# Altium project GN-1846-A-V2_RTL8211E.PrjPcb
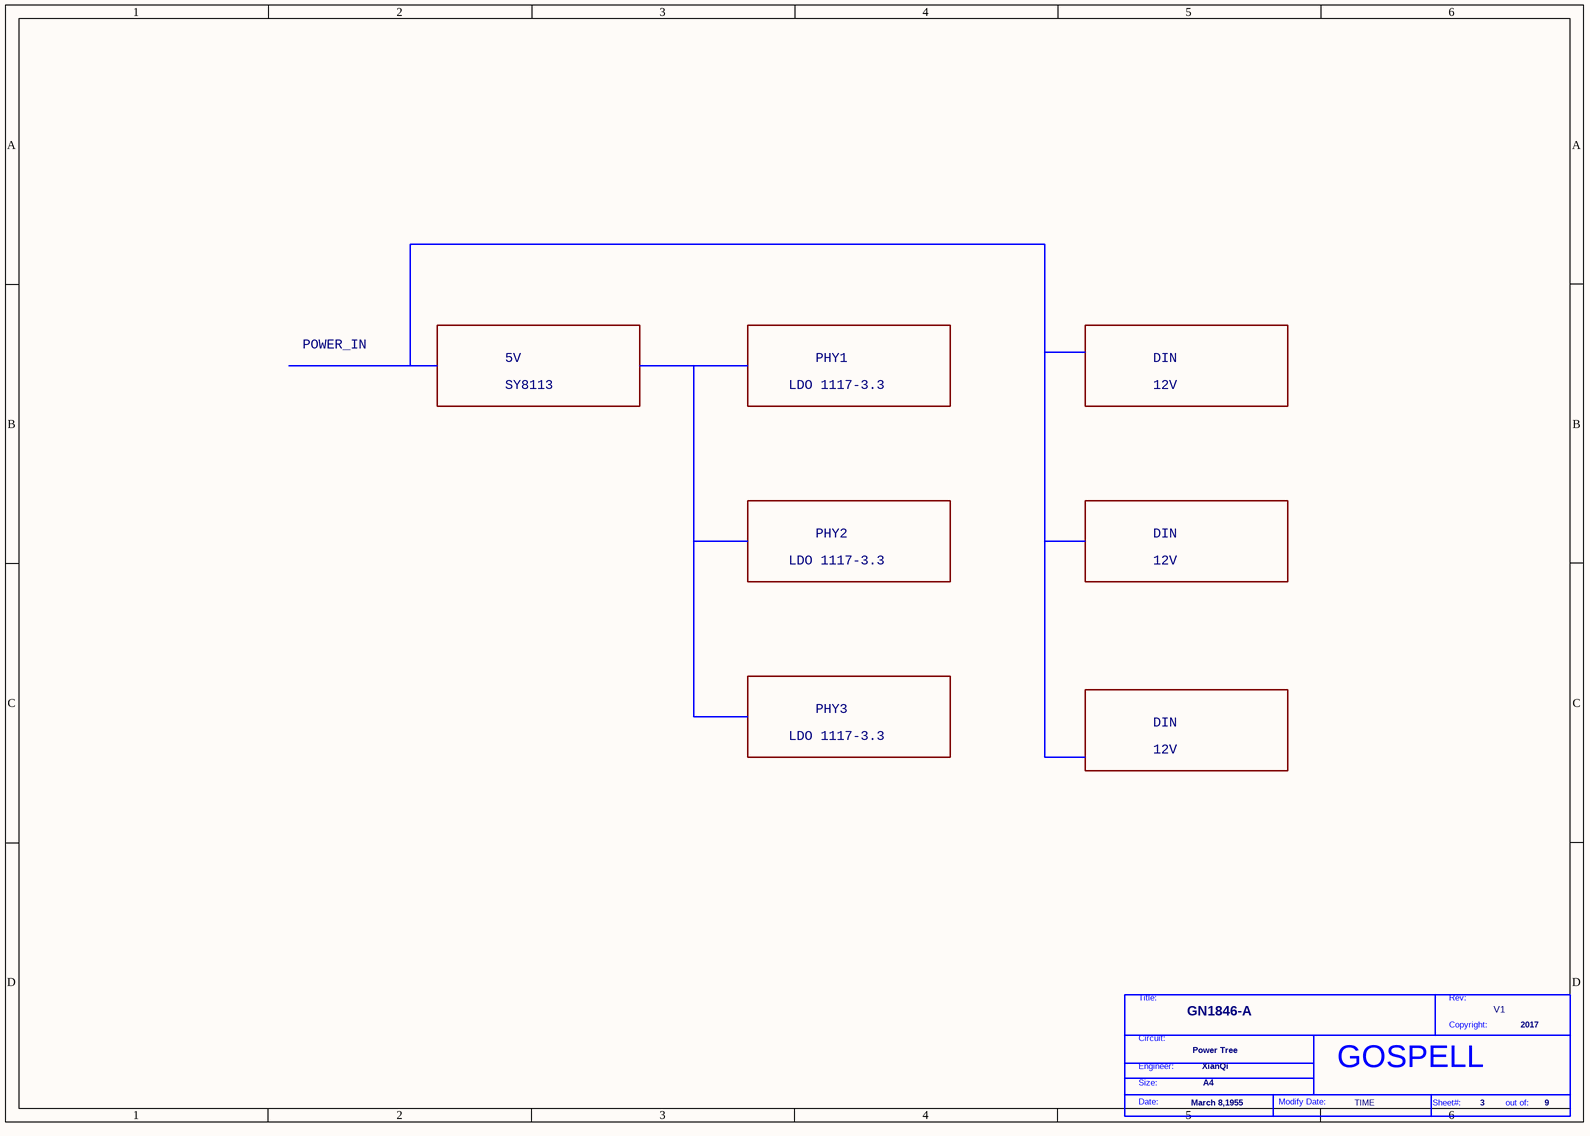
[diagram p0: P03 Power Tree.SchDoc]
9 sheets, 459 parts. Net scope: flat (ports and power ports of the same name join across sheets).
Board file: GN-1846-A-V2.PcbDoc
Sheets:
  P03 Power Tree.SchDoc
  P04 Power.SchDoc
  P07 PHY 2.SchDoc
  P09 CONNECT & LED.SchDoc
  P08 PHY 3.SchDoc
  P06 PHY 1.SchDoc
  P05 CPLD.SchDoc
  P02 Block.SchDoc
  P01 Note & Title.SchDoc

## Sheet P03 Power Tree.SchDoc
size 297 x 209 mm

### Parts
(Parts that share a designator on the sheet are numbered #1, #2 ... from top to bottom, then left to right.)
*#1  Doc: Power Tree  Page Count: 9  Page Number: 3  Page Create Date: March 8,1955  Page Size: A4  RevCode: V1  Title: GN1846-A  Copyright: 2017  Engineer: XianQi  Page Modify Date: TIME  (hidden comment: GOSPELL)  (graphical)

### Notes on the sheet
- POWER_IN
- 5V
- SY8113
- LDO 1117-3.3
- PHY1
- DIN
- 12V
- PHY2
- PHY3
- (in symbol GOSPELL) Title:; Rev:; Copyright:; Circuit:; Engineer:; Size:; Date:; Modify Date:; Sheet#:; out of:

### Library data of the parts
*#1 = GOSPELL: Cage Code: 2017; Schematic Page Count: 9; Schematic Page Number: 3

## Sheet P04 Power.SchDoc
size 246 x 182 mm
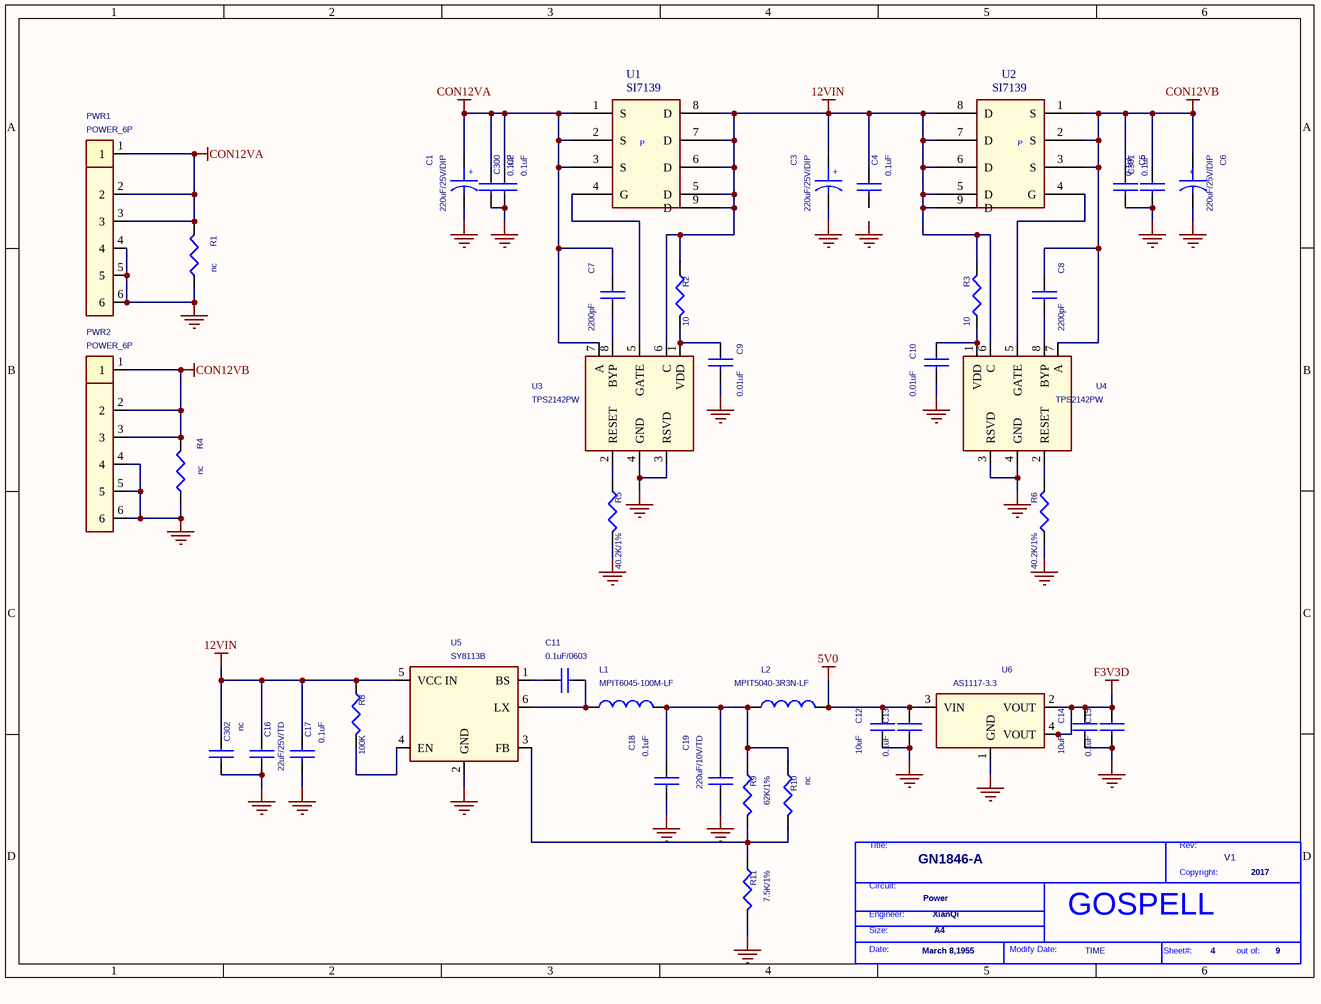
[diagram p1: P04 Power.SchDoc]

### Parts
(Parts that share a designator on the sheet are numbered #1, #2 ... from top to bottom, then left to right.)
*#2  Doc: Power  Page Count: 9  Page Number: 4  Page Create Date: March 8,1955  Page Size: A4  RevCode: V1  Title: GN1846-A  Copyright: 2017  Engineer: XianQi  Page Modify Date: TIME  (hidden comment: GOSPELL)  (graphical)
C1  220uF/25V/DIP  [CE8X3.5]
C2  0.1uF  [0402C]
C3  220uF/25V/DIP  [CE8X3.5]
C4  0.1uF  [0402C]
C5  0.1uF  [0402C]
C6  220uF/25V/DIP  [CE8X3.5]
C7  2200pF  [0402C]
C8  2200pF  [0402C]
C9  0.01uF  [0402C]
C10  0.01uF  [0402C]
C11  0.1uF/0603  [0402C]
C12  10uF  [C0603]
C13  0.1uF  [0402C]
C14  10uF  [C0603]
C15  0.1uF  [0402C]
C16  22uF/25V/TD  [C6032]
C17  0.1uF  [0402C]
C18  0.1uF  [0402C]
C19  220uF/10V/TD  [C6032]
C300  0.1uF  [C1206]
C301  0.1uF  [C1206]
C302  nc  [C1206]
L1  MPIT6045-100M-LF  [MPI6045]
L2  MPIT5040-3R3N-LF  [FB0805]
PWR1  POWER_6P  [TJC2-6]
PWR2  POWER_6P  [TJC2-6]
R1  nc  [0805]
R2  10  [R0603]
R3  10  [R0603]
R4  nc  [0805]
R5  40.2K/1%  [0402R]
R6  40.2K/1%  [0402R]
R8  100K  [0402R]
R9  62K/1%  [0402R]
R10  nc  [0402R]
R11  7.5K/1%  [0402R]
U1  SI7139  [PowerPAKSO8]
U2  SI7139  [PowerPAKSO8]
U3  TPS2142PW  [TSSOP-8]
U4  TPS2142PW  [TSSOP-8]
U5  SY8113B  [SOT23_6_G]
U6  AS1117-3.3  [SOT223]

### Nets
5V0: C12.1 C13.1 L2.2 U6.3(VIN)
12VIN: C3.1 C4.1 C16.1 C17.1 C302.1 R2.1 R3.1 R8.1 U1.5(D) U1.6(D) U1.7(D) U1.8(D) U1.9(D) U2.5(D) U2.6(D) U2.7(D) U2.8(D) U2.9(D) U3.6(C) U4.6(C) U5.5(VCC_IN)
CON12VA: C1.1 C2.1 C7.1 C300.1 PWR1.1 PWR1.2 PWR1.3 R1.1 U1.1(S) U1.2(S) U1.3(S) U3.7(A)
CON12VB: C5.1 C6.1 C8.1 C301.1 PWR2.1 PWR2.2 PWR2.3 R4.1 U2.1(S) U2.2(S) U2.3(S) U4.7(A)
F3V3D: C14.1 C15.1 U6.2(VOUT) U6.4(VOUT)
GND: C1.2 C2.2 C3.2 C5.2 C6.2 C9.2 C10.2 C12.2 C13.2 C14.2 C15.2 C16.2 C17.2 C18.2 C19.2 C300.2 C301.2 C302.2 PWR1.4 PWR1.5 PWR1.6 PWR2.4 PWR2.5 PWR2.6 R1.2 R4.2 R5.2 R6.2 R11.2 U3.3(RSVD) U3.4(GND) U4.3(RSVD) U4.4(GND) U5.2(GND) U6.1(GND)
NetC7_2: C7.2 U3.8(BYP)
NetC8_2: C8.2 U4.8(BYP)
NetC9_1: C9.1 R2.2 U3.1(VDD)
NetC10_1: C10.1 R3.2 U4.1(VDD)
NetC11_1: C11.1 U5.1(BS)
NetC11_2: C11.2 L1.1 U5.6(LX)
NetC18_1: C18.1 C19.1 L1.2 L2.1 R9.1 R10.1
NetR5_1: R5.1 U3.2(RESET)
NetR6_1: R6.1 U4.2(RESET)
NetR8_2: R8.2 U5.4(EN)
NetR9_2: R9.2 R10.2 R11.1 U5.3(FB)
NetU1_4: U1.4(G) U3.5(GATE)
NetU2_4: U2.4(G) U4.5(GATE)

Not connected (* = marked no-connect by the designer): C4 2

### Notes on the sheet
- Labels drawn without touching a wire or pin: GND
- (in symbol CAP POL) +
- (in symbol GOSPELL) Title:; Rev:; Copyright:; Circuit:; Engineer:; Size:; Date:; Modify Date:; Sheet#:; out of:
- (in symbol SI7139) P

### Library data of the parts
C1 C3 C6 = CAP POL
C2 C4 C5 C7-C11 C16-C19 C300-C302 = CAP NP
C12-C15 = CAP NP_Dup1
L1 L2 = CHOKE TORROID_0
PWR1 PWR2 = POWER_4P
R1-R6 R8-R11 = R
U5 = SY8120
U6 = AS1117-X_0
*#2 = GOSPELL: Cage Code: 2017; Schematic Page Count: 9; Schematic Page Number: 4

## Sheet P07 PHY 2.SchDoc
size 420 x 297 mm
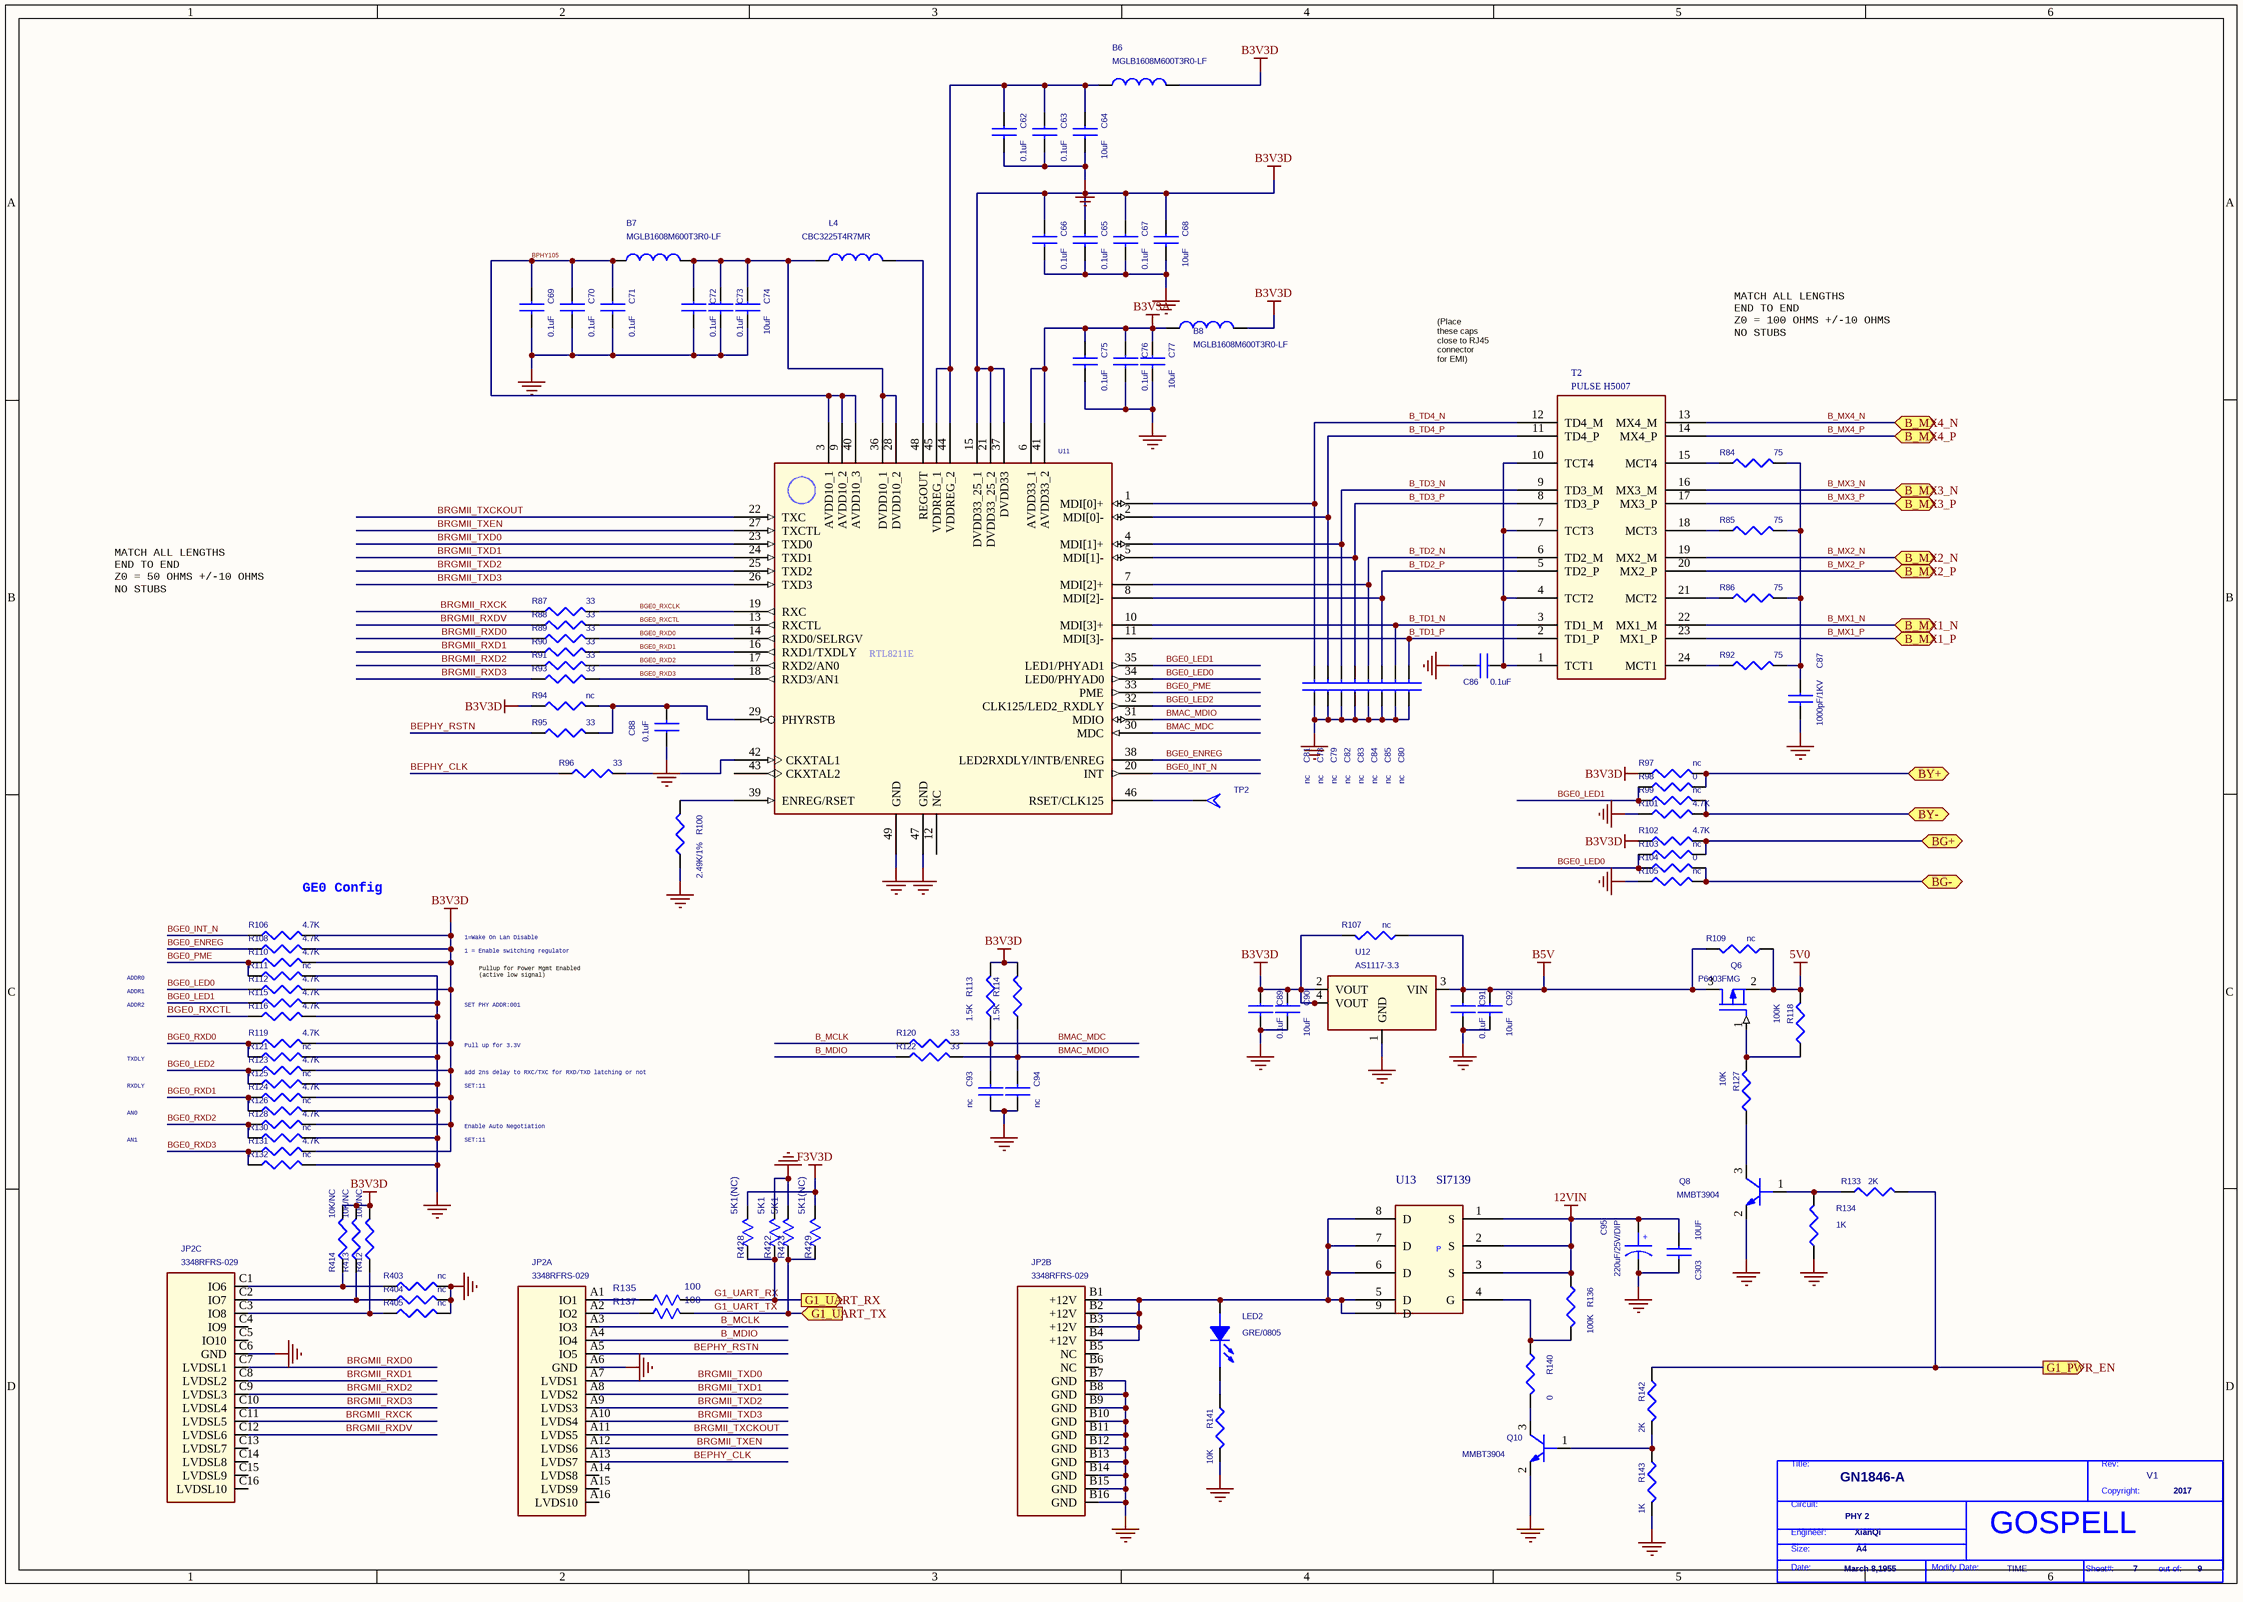
[diagram p2: P07 PHY 2.SchDoc]

### Parts
(Parts that share a designator on the sheet are numbered #1, #2 ... from top to bottom, then left to right.)
*#3  Doc: PHY 2  Page Count: 9  Page Number: 7  Page Create Date: March 8,1955  Page Size: A4  RevCode: V1  Title: GN1846-A  Copyright: 2017  Engineer: XianQi  Page Modify Date: TIME  (hidden comment: GOSPELL)  (graphical)
B6  MGLB1608M600T3R0-LF  [L0603]
B7  MGLB1608M600T3R0-LF  [L0603]
B8  MGLB1608M600T3R0-LF  [L0603]
C62  0.1uF  [0402C]
C63  0.1uF  [0402C]
C64  10uF  [C0603]
C65  0.1uF  [0402C]
C66  0.1uF  [0402C]
C67  0.1uF  [0402C]
C68  10uF  [C0603]
C69  0.1uF  [0402C]
C70  0.1uF  [0402C]
C71  0.1uF  [0402C]
C72  0.1uF  [0402C]
C73  0.1uF  [0402C]
C74  10uF  [C0603]
C75  0.1uF  [0402C]
C76  0.1uF  [0402C]
C77  10uF  [C0603]
C78  nc  [0402C]
C79  nc  [0402C]
C80  nc  [0402C]
C81  nc  [0402C]
C82  nc  [0402C]
C83  nc  [0402C]
C84  nc  [0402C]
C85  nc  [0402C]
C86  0.1uF  [0402C]
C87  1000pF/1KV  [C1206]
C88  0.1uF  [0402C]
C89  0.1uF  [0402C]
C90  10uF  [C0603]
C91  0.1uF  [0402C]
C92  10uF  [C0603]
C93  nc  [0402C]
C94  nc  [0402C]
C95  220uF/25V/DIP  [CE8X3.5]
C303  10UF  [C1206]
JP2  3348RFRS-029  [3348RFRS-029]  (parts A,B,C of 3)
L4  CBC3225T4R7MR  [FB0805]
LED2  GRE/0805  [LED0805]
Q6  P6403FMG  [SOT23]
Q8  MMBT3904  [SOT23]
Q10  MMBT3904  [SOT23]
R84  75  [0402R]
R85  75  [0402R]
R86  75  [0402R]
R87  33  [0402R]
R88  33  [0402R]
R89  33  [0402R]
R90  33  [0402R]
R91  33  [0402R]
R92  75  [0402R]
R93  33  [0402R]
R94  nc  [0402R]
R95  33  [0402R]
R96  33  [0402R]
R97  nc  [0402R]
R98  0  [0402R]
R99  nc  [0402R]
R100  2.49K/1%  [0402R]
R101  4.7K  [0402R]
R102  4.7K  [0402R]
R103  nc  [0402R]
R104  0  [0402R]
R105  nc  [0402R]
R106  4.7K  [0402R]
R107  nc  [R0603]
R108  4.7K  [0402R]
R109  nc  [R0603]
R110  4.7K  [0402R]
R111  nc  [0402R]
R112  4.7K  [0402R]
R113  1.5K  [0402R]
R114  1.5K  [0402R]
R115  4.7K  [0402R]
R116  4.7K  [0402R]
R118  100K  [0402R]
R119  4.7K  [0402R]
R120  33  [0402R]
R121  nc  [0402R]
R122  33  [0402R]
R123  4.7K  [0402R]
R124  4.7K  [0402R]
R125  nc  [0402R]
R126  nc  [0402R]
R127  10K  [0402R]
R128  4.7K  [0402R]
R130  nc  [0402R]
R131  4.7K  [0402R]
R132  nc  [0402R]
R133  2K  [0402R]
R134  1K  [0402R]
R135  100  [0402R]
R136  100K  [R0603]
R137  100  [0402R]
R140  0  [0402R]
R141  10K  [0402R]
R142  2K  [0402R]
R143  1K  [0402R]
R403  nc  [0402R]
R404  nc  [0402R]
R405  nc  [0402R]
R412  10K/NC  [0402R]
R413  10K/NC  [0402R]
R414  10K/NC  [0402R]
R422  5K1  [0402R]
R423  5K1  [0402R]
R428  5K1(NC)  [0402R]
R429  5K1(NC)  [0402R]
T2  PULSE H5007  [H5007-H]
TP2  T POINT A  [TP_G]  (value not drawn)
U11  RTL8211D  [QFN-48P-RTL8211]  (value not drawn)
U12  AS1117-3.3  [SOT223]
U13  SI7139  [PowerPAKSO8]

### Ports
B_MX1_N (bidir), B_MX1_P (bidir), B_MX2_N (bidir), B_MX2_P (bidir), B_MX3_N (bidir), B_MX3_P (bidir), B_MX4_N (bidir), B_MX4_P (bidir), BG+ (bidir), BG- (bidir), BY+ (bidir), BY- (bidir), G1_PWR_EN (out), G1_UART_RX (out), G1_UART_TX (in)

### Nets
5V0: Q6.2(SOURCE) R109.2 R118.1
12VIN: C95.1 C303.1 R136.2 U13.1(S) U13.2(S) U13.3(S)
B3V3A: B8.1 C75.1 C76.1 C77.1 U11.6(AVDD33_1) U11.41(AVDD33_2)
B3V3D: B6.2 B8.2 C65.1 C66.1 C67.1 C68.1 C89.1 C90.1 R94.1 R97.1 R102.1 R106.2 R107.1 R108.2 R110.2 R112.2 R113.2 R114.2 R119.2 R123.2 R124.2 R128.2 R131.2 R412.2 R413.2 R414.2 U11.15(DVDD33_25_1) U11.21(DVDD33_25_2) U11.37(DVDD33) U12.2(VOUT) U12.4(VOUT)
B5V: C91.1 C92.1 Q6.3(DRAIN) R107.2 R109.1 U12.3(VIN)
F3V3D: R428.2(B) R429.2(B)
GND: C62.2 C63.2 C64.2 C65.2 C66.2 C67.2 C68.2 C69.2 C70.2 C71.2 C72.2 C73.2 C74.2 C75.2 C76.2 C77.2 C78.1 C79.1 C80.1 C81.1 C82.1 C83.1 C84.1 C85.1 C86.2 C87.2 C88.1 C89.2 C90.2 C91.2 C92.2 C93.1 C94.1 C95.2 C303.2 JP2.A6(GND) JP2.B7(GND) JP2.B8(GND) JP2.B9(GND) JP2.B10(GND) JP2.B11(GND) JP2.B12(GND) JP2.B13(GND) JP2.B14(GND) JP2.B15(GND) JP2.B16(GND) JP2.C6(GND) Q8.2(EMITTER) Q10.2(EMITTER) R100.1 R101.1 R105.1 R111.2 R115.2 R116.2 R121.2 R125.2 R126.2 R130.2 R132.2 R134.1 R141.1 R143.1 R403.2 R404.2 R405.2 R422.2(B) R423.2(B) U11.47(GND) U11.49(GND) U12.1(GND)
B_MCLK: JP2.A3(IO3) R120.1
B_MDIO: JP2.A4(IO4) R122.1
B_MX1_N: T2.22(MX1_M) ; port B_MX1_N
B_MX1_P: T2.23(MX1_P) ; port B_MX1_P
B_MX2_N: T2.19(MX2_M) ; port B_MX2_N
B_MX2_P: T2.20(MX2_P) ; port B_MX2_P
B_MX3_N: T2.16(MX3_M) ; port B_MX3_N
B_MX3_P: T2.17(MX3_P) ; port B_MX3_P
B_MX4_N: T2.13(MX4_M) ; port B_MX4_N
B_MX4_P: T2.14(MX4_P) ; port B_MX4_P
B_TD1_N: C85.2 T2.3(TD1_M) U11.10(MDI[3]+)
B_TD1_P: C80.2 T2.2(TD1_P) U11.11(MDI[3]-)
B_TD2_N: C83.2 T2.6(TD2_M) U11.7(MDI[2]+)
B_TD2_P: C84.2 T2.5(TD2_P) U11.8(MDI[2]-)
B_TD3_N: C79.2 T2.9(TD3_M) U11.4(MDI[1]+)
B_TD3_P: C82.2 T2.8(TD3_P) U11.5(MDI[1]-)
B_TD4_N: C81.2 T2.12(TD4_M) U11.1(MDI[0]+)
B_TD4_P: C78.2 T2.11(TD4_P) U11.2(MDI[0]-)
BEPHY_CLK: JP2.A13(LVDS7) R96.1
BEPHY_RSTN: JP2.A5(IO5) R95.1
BGE0_ENREG: R108.1 U11.38(LED2RXDLY/INTB/ENREG)
BGE0_INT_N: R106.1 U11.20(INT)
BGE0_LED0: R103.1 R104.1 R112.1 U11.34(LED0/PHYAD0)
BGE0_LED1: R98.1 R99.1 R115.1 U11.35(LED1/PHYAD1)
BGE0_LED2: R123.1 R125.1 U11.32(CLK125/LED2_RXDLY)
BGE0_PME: R110.1 R111.1 U11.33(PME)
BGE0_RXCLK: R87.2 U11.19(RXC)
BGE0_RXCTL: R88.2 R116.1 U11.13(RXCTL)
BGE0_RXD0: R89.2 R119.1 R121.1 U11.14(RXD0/SELRGV)
BGE0_RXD1: R90.2 R124.1 R126.1 U11.16(RXD1/TXDLY)
BGE0_RXD2: R91.2 R128.1 R130.1 U11.17(RXD2/AN0)
BGE0_RXD3: R93.2 R131.1 R132.1 U11.18(RXD3/AN1)
BMAC_MDC: C93.2 R113.1 R120.2 U11.30(MDC)
BMAC_MDIO: C94.2 R114.1 R122.2 U11.31(MDIO)
BPHY105: B7.1 C69.1 C70.1 C71.1 U11.3(AVDD10_1) U11.9(AVDD10_2) U11.40(AVDD10_3)
BRGMII_RXCK: JP2.C11(LVDSL5) R87.1
BRGMII_RXD0: JP2.C7(LVDSL1) R89.1
BRGMII_RXD1: JP2.C8(LVDSL2) R90.1
BRGMII_RXD2: JP2.C9(LVDSL3) R91.1
BRGMII_RXD3: JP2.C10(LVDSL4) R93.1
BRGMII_RXDV: JP2.C12(LVDSL6) R88.1
BRGMII_TXCKOUT: JP2.A11(LVDS5) U11.22(TXC)
BRGMII_TXD0: JP2.A7(LVDS1) U11.23(TXD0)
BRGMII_TXD1: JP2.A8(LVDS2) U11.24(TXD1)
BRGMII_TXD2: JP2.A9(LVDS3) U11.25(TXD2)
BRGMII_TXD3: JP2.A10(LVDS4) U11.26(TXD3)
BRGMII_TXEN: JP2.A12(LVDS6) U11.27(TXCTL)
G1_UART_RX: R135.2(B) R422.1(A) R428.1(A) ; port G1_UART_RX
G1_UART_TX: R137.2(B) R423.1(A) R429.1(A) ; port G1_UART_TX
NetB6_1: B6.1 C62.1 C63.1 C64.1 U11.44(VDDREG_2) U11.45(VDDREG_1)
NetB7_2: B7.2 C72.1 C73.1 C74.1 L4.1 U11.28(DVDD10_2) U11.36(DVDD10_1)
NetC86_1: C86.1 T2.1(TCT1) T2.4(TCT2) T2.7(TCT3) T2.10(TCT4)
NetC87_1: C87.1 R84.2 R85.2 R86.2 R92.2
NetC88_2: C88.2 R94.2 R95.2 U11.29(PHYRSTB)
NetJ2_19: R99.2 R101.2 ; port BY-
NetJ2_20: R97.2 R98.2 ; port BY+
NetJ2_23: R104.2 R105.2 ; port BG-
NetJ2_24: R102.2 R103.2 ; port BG+
NetJP2_A1: JP2.A1(IO1) R135.1(A)
NetJP2_A2: JP2.A2(IO2) R137.1(A)
NetJP2_B1: JP2.B1(+12V) JP2.B2(+12V) JP2.B3(+12V) JP2.B4(+12V) LED2.A(ANODE) U13.5(D) U13.6(D) U13.7(D) U13.8(D) U13.9(D)
NetJP2_C1: JP2.C1(IO6) R403.1 R414.1
NetJP2_C2: JP2.C2(IO7) R404.1 R413.1
NetJP2_C3: JP2.C3(IO8) R405.1 R412.1
NetL4_2: L4.2 U11.48(REGOUT)
NetLED2_K: LED2.K(CATHODE) R141.2
NetQ6_1: Q6.1(GATE) R118.2 R127.1
NetQ8_1: Q8.1(BASE) R133.1 R134.2
NetQ8_3: Q8.3(COLLECTOR) R127.2
NetQ10_1: Q10.1(BASE) R142.1 R143.2
NetQ10_3: Q10.3(COLLECTOR) R140.1
NetR84_1: R84.1 T2.15(MCT4)
NetR85_1: R85.1 T2.18(MCT3)
NetR86_1: R86.1 T2.21(MCT2)
NetR92_1: R92.1 T2.24(MCT1)
NetR96_2: R96.2 U11.42(CKXTAL1)
NetR100_2: R100.2 U11.39(ENREG/RSET)
NetR133_2: R133.2 R142.2 ; port G1_PWR_EN
NetR136_1: R136.1 R140.2 U13.4(G)
NetTP2_1: TP2.1(TP) U11.46(RSET/CLK125)

Not connected (* = marked no-connect by the designer): JP2 A14(LVDS8) A15(LVDS9) A16(LVDS10) B5(NC) B6(NC) C4(IO9) C5(IO10) C13(LVDSL7) C14(LVDSL8) C15(LVDSL9) C16(LVDSL10); U11 12(NC) 43(CKXTAL2)

### Notes on the sheet
- (Place
  these caps
  close to RJ45
  connector
  for EMI)
- MATCH ALL LENGTHS
  END TO END
  Z0 = 100 OHMS +/-10 OHMS
  NO STUBS
- MATCH ALL LENGTHS
  END TO END
  Z0 = 50 OHMS +/-10 OHMS
  NO STUBS
- GE0 Config
- 1=Wake On Lan Disable
- ADDR0
- ADDR1
- 1 = Enable switching regulator
- Pullup for Power Mgmt Enabled
  (active low signal)
- ADDR2
- TXDLY
- SET PHY ADDR:001
- Pull up for 3.3V
- add 2ns delay to RXC/TXC for RXD/TXD latching or not
- AN0
- RXDLY
- Enable Auto Negotiation
- SET:11
- AN1
- (in symbol CAP POL) +
- (in symbol GOSPELL) Title:; Rev:; Copyright:; Circuit:; Engineer:; Size:; Date:; Modify Date:; Sheet#:; out of:
- (in symbol RTL8211D_1) RTL8211E
- (in symbol SI7139) P

### Library data of the parts
B6-B8 L4 = CHOKE TORROID_0
C62-C94 = CAP NP_Dup1
C95 = CAP POL
C303 = CAP NP
LED2 = LED_0
Q6 = MOSFET P_0
Q8 Q10 = 2N3904
R84-R106 R108 R110-R116 R119-R126 R128 R130-R132 R136 R140-R143 R403-R405 R412-R414 = R_Dup1
R107 R109 R118 R127 R133 R134 = R
R135 R137 R422 R423 R428 R429 = R_1: PARTS: 1; OriginalSymbolOrigin: (10,20); PINSWAP: (A,B); DEVICE: RK73H1JTTD7502F; PKG_TYPE: SR0603; LEVEL: STD; %208%%161%%192%%224%%195%%251%%179%%198%: 片式厚膜电阻器; COMPONENT_HIGH_MAX: 0.55MM; %215%%232%%214%%181%%212%%202%%208%%237%%198%%171%%178%%238%: +/-1%; %182%%238%%182%%168%%185%%166%%194%%202%(W): 0.1; %195%%232%%202%%246%: 片式厚膜电阻器-0.1W-75000OHM-+/-1%-0603; CODE: 7091238
T2 = PULSE H5007_0
U11 = RTL8211D_1
U12 = AS1117-X_1
*#3 = GOSPELL: Cage Code: 2017; Schematic Page Count: 9; Schematic Page Number: 7

## Sheet P09 CONNECT & LED.SchDoc
size A2
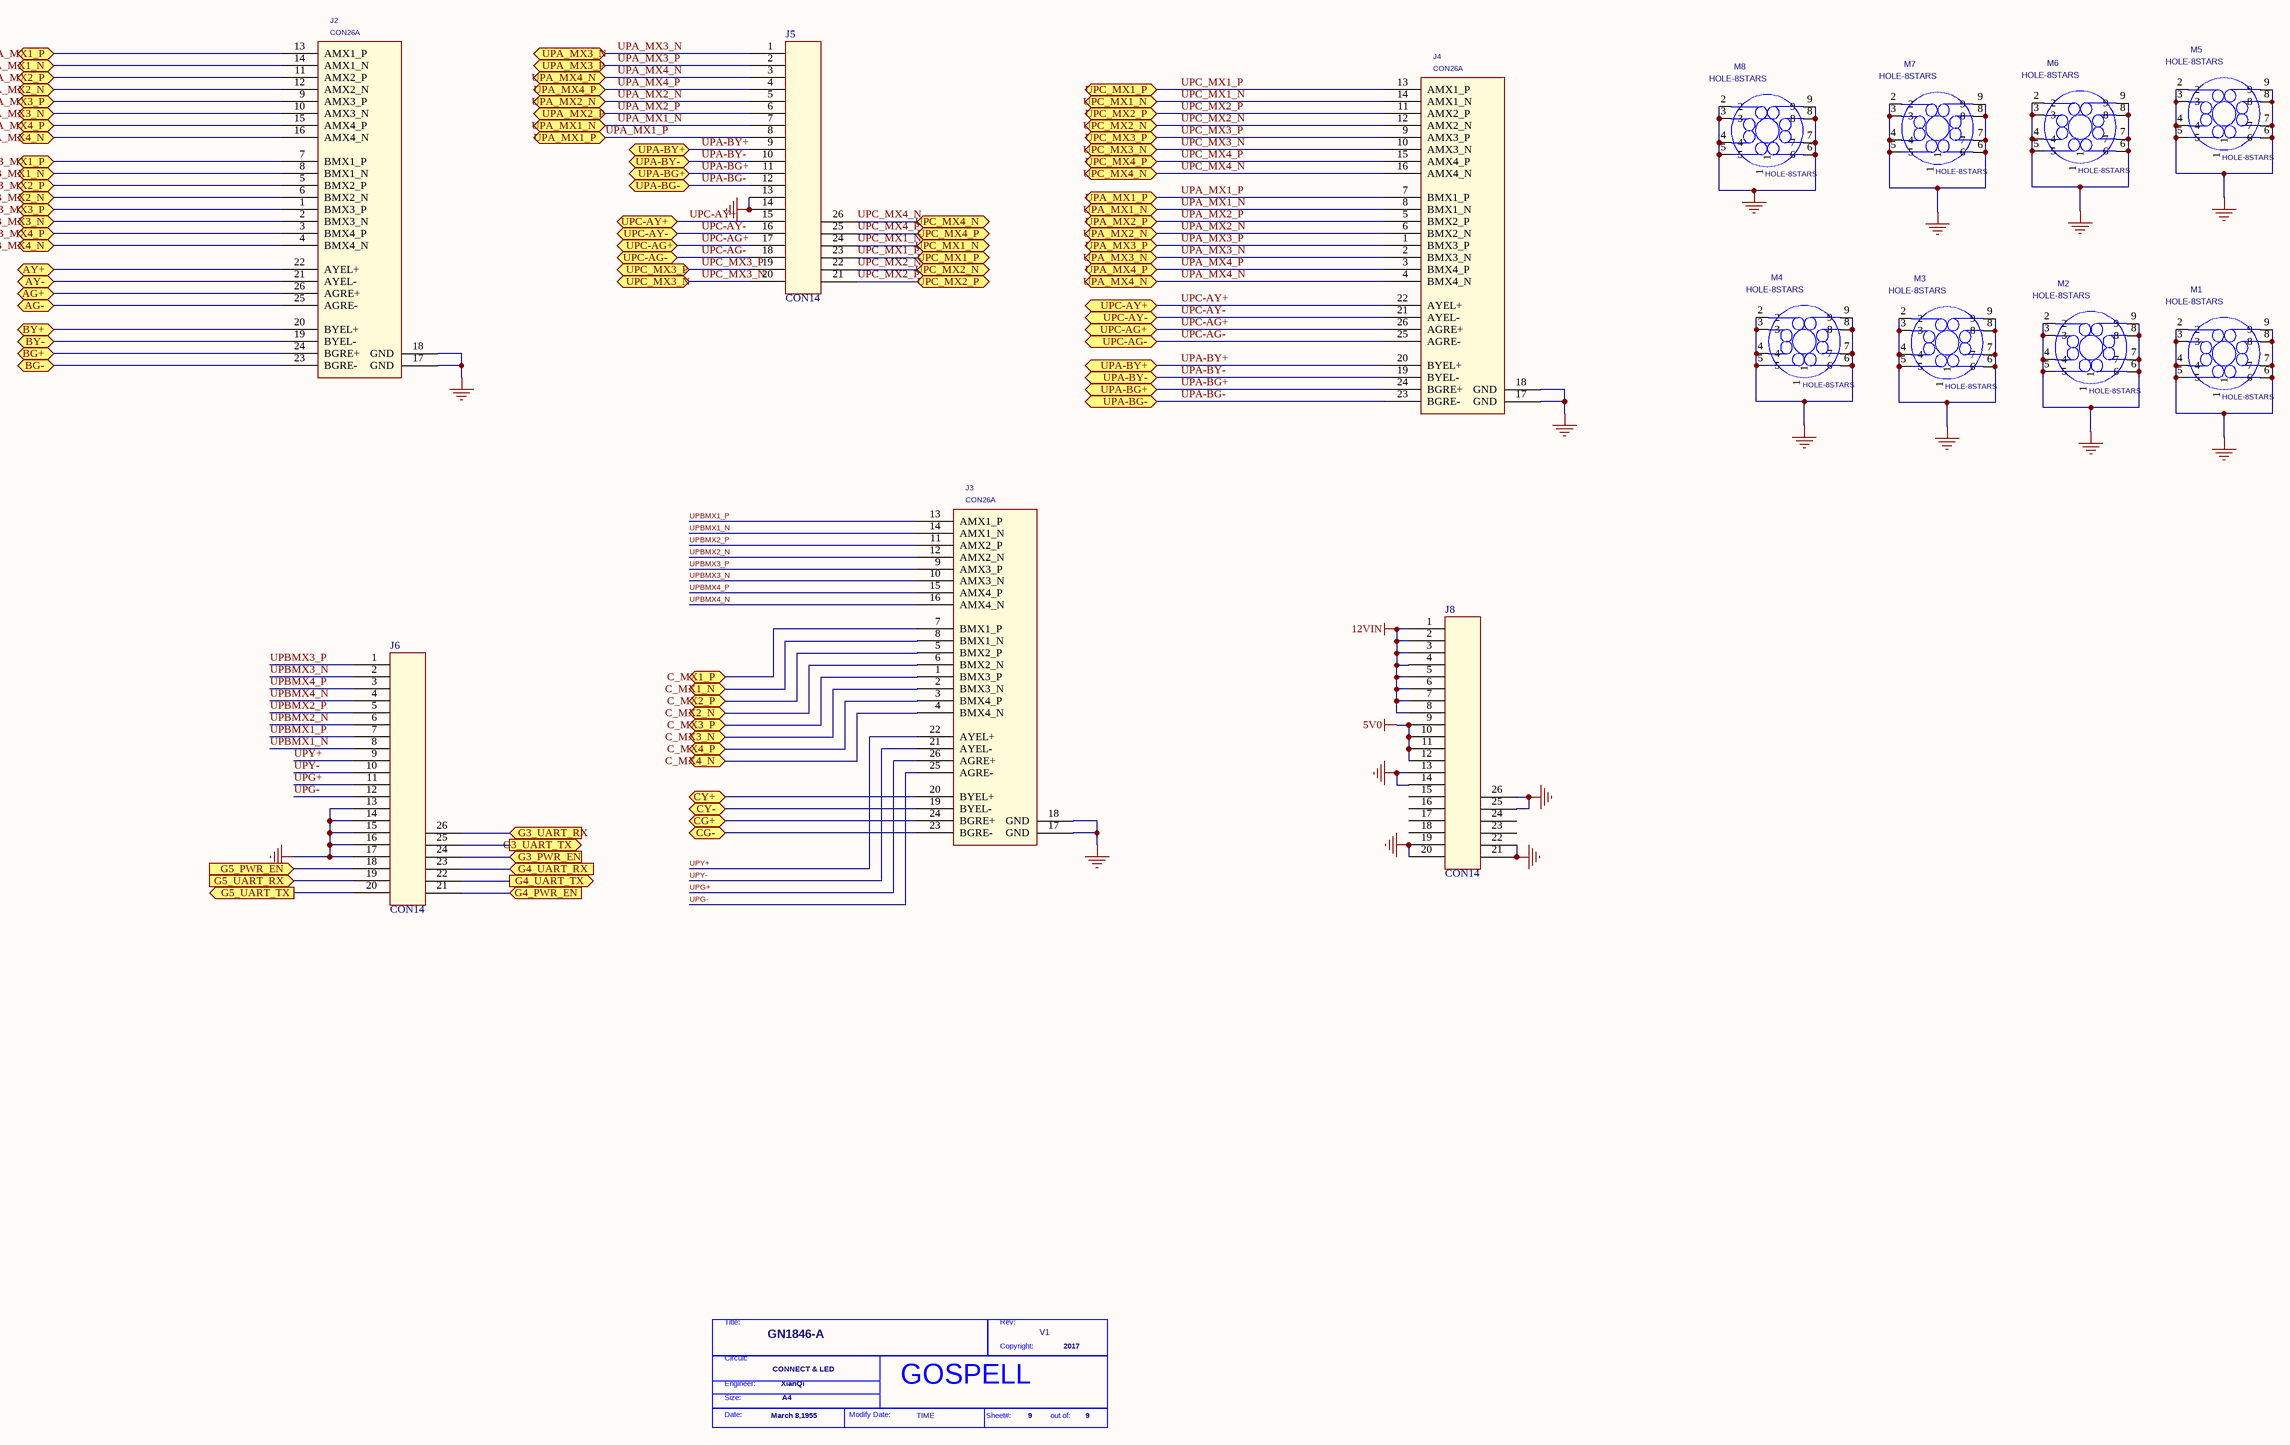
[diagram p3: P09 CONNECT & LED.SchDoc]

### Parts
(Parts that share a designator on the sheet are numbered #1, #2 ... from top to bottom, then left to right.)
*#4  Doc: CONNECT & LED  Page Count: 9  Page Create Date: March 8,1955  Page Size: A4  RevCode: V1  Title: GN1846-A  Copyright: 2017  Engineer: XianQi  Page Modify Date: TIME  (hidden comment: GOSPELL)  (graphical)
J2  CON26A  [HERDER2X13]
J3  CON26A  [HERDER2X13]
J4  CON26A  [HERDER2X13]
J5  CON14  [HERDER13X2-2.0]
J6  CON14  [HERDER13X2-2.0]
J8  CON14  [HERDER13X2-2.0]
M1  HOLE-8STARS  [HK]
M2  HOLE-8STARS  [HK]
M3  HOLE-8STARS  [HK]
M4  HOLE-8STARS  [HK]
M5  HOLE-8STARS  [HK]
M6  HOLE-8STARS  [HK]
M7  HOLE-8STARS  [HK]
M8  HOLE-8STARS  [HK]

### Ports
A_MX1_N (bidir), A_MX1_P (bidir), A_MX2_N (bidir), A_MX2_P (bidir), A_MX3_N (bidir), A_MX3_P (bidir), A_MX4_N (bidir), A_MX4_P (bidir), AG+ (bidir), AG- (bidir), AY+ (bidir), AY- (bidir), B_MX1_N (bidir), B_MX1_P (bidir), B_MX2_N (bidir), B_MX2_P (bidir), B_MX3_N (bidir), B_MX3_P (bidir), B_MX4_N (bidir), B_MX4_P (bidir), BG+ (bidir), BG- (bidir), BY+ (bidir), BY- (bidir), C_MX1_N (bidir), C_MX1_P (bidir), C_MX2_N (bidir), C_MX2_P (bidir), C_MX3_N (bidir), C_MX3_P (bidir), C_MX4_N (bidir), C_MX4_P (bidir), CG+ (bidir), CG- (bidir), CY+ (bidir), CY- (bidir), G3_PWR_EN (in), G3_UART_RX (in), G3_UART_TX (out), G4_PWR_EN (in), G4_UART_RX (in), G4_UART_TX (out), G5_PWR_EN (in), G5_UART_RX (in), G5_UART_TX (out), UPA-BG+ (bidir), UPA-BG- (bidir), UPA-BY+ (bidir), UPA-BY- (bidir), UPA_MX1_N (bidir), UPA_MX1_P (bidir), UPA_MX2_N (bidir), UPA_MX2_P (bidir), UPA_MX3_N (bidir), UPA_MX3_P (bidir), UPA_MX4_N (bidir), UPA_MX4_P (bidir), UPC-AG+ (bidir), UPC-AG- (bidir), UPC-AY+ (bidir), UPC-AY- (bidir), UPC_MX1_N (bidir), UPC_MX1_P (bidir), UPC_MX2_N (bidir), UPC_MX2_P (bidir), UPC_MX3_N (bidir), UPC_MX3_P (bidir), UPC_MX4_N (bidir), UPC_MX4_P (bidir)

### Nets
5V0: J8.9 J8.10 J8.11 J8.12
12VIN: J8.1 J8.2 J8.3 J8.4 J8.5 J8.6 J8.7 J8.8
GND: J2.17(GND) J2.18(GND) J3.17(GND) J3.18(GND) J4.17(GND) J4.18(GND) J5.13 J5.14 J6.13 J6.14 J6.15 J6.16 J6.17 J8.13 J8.14 J8.19 J8.20 J8.21 J8.22 J8.25 J8.26 M1.2 M1.3 M1.4 M1.5 M1.6 M1.7 M1.8 M1.9 M2.2 M2.3 M2.4 M2.5 M2.6 M2.7 M2.8 M2.9 M3.2 M3.3 M3.4 M3.5 M3.6 M3.7 M3.8 M3.9 M4.2 M4.3 M4.4 M4.5 M4.6 M4.7 M4.8 M4.9 M5.2 M5.3 M5.4 M5.5 M5.6 M5.7 M5.8 M5.9 M6.2 M6.3 M6.4 M6.5 M6.6 M6.7 M6.8 M6.9 M7.2 M7.3 M7.4 M7.5 M7.6 M7.7 M7.8 M7.9 M8.2 M8.3 M8.4 M8.5 M8.6 M8.7 M8.8 M8.9
A_MX1_N: J2.14(AMX1_N) ; port A_MX1_N
A_MX1_P: J2.13(AMX1_P) ; port A_MX1_P
A_MX2_N: J2.12(AMX2_N) ; port A_MX2_N
A_MX2_P: J2.11(AMX2_P) ; port A_MX2_P
A_MX3_N: J2.10(AMX3_N) ; port A_MX3_N
A_MX3_P: J2.9(AMX3_P) ; port A_MX3_P
A_MX4_N: J2.16(AMX4_N) ; port A_MX4_N
A_MX4_P: J2.15(AMX4_P) ; port A_MX4_P
B_MX1_N: J2.8(BMX1_N) ; port B_MX1_N
B_MX1_P: J2.7(BMX1_P) ; port B_MX1_P
B_MX2_N: J2.6(BMX2_N) ; port B_MX2_N
B_MX2_P: J2.5(BMX2_P) ; port B_MX2_P
B_MX3_N: J2.2(BMX3_N) ; port B_MX3_N
B_MX3_P: J2.1(BMX3_P) ; port B_MX3_P
B_MX4_N: J2.4(BMX4_N) ; port B_MX4_N
B_MX4_P: J2.3(BMX4_P) ; port B_MX4_P
C_MX1_N: J3.8(BMX1_N) ; port C_MX1_N
C_MX1_P: J3.7(BMX1_P) ; port C_MX1_P
C_MX2_N: J3.6(BMX2_N) ; port C_MX2_N
C_MX2_P: J3.5(BMX2_P) ; port C_MX2_P
C_MX3_N: J3.2(BMX3_N) ; port C_MX3_N
C_MX3_P: J3.1(BMX3_P) ; port C_MX3_P
C_MX4_N: J3.4(BMX4_N) ; port C_MX4_N
C_MX4_P: J3.3(BMX4_P) ; port C_MX4_P
UPA-BG+: J4.24(BGRE+) J5.11 ; port UPA-BG+
UPA-BG-: J4.23(BGRE-) J5.12 ; port UPA-BG-
UPA-BY+: J4.20(BYEL+) J5.9 ; port UPA-BY+
UPA-BY-: J4.19(BYEL-) J5.10 ; port UPA-BY-
UPA_MX1_N: J4.8(BMX1_N) J5.7 ; port UPA_MX1_N
UPA_MX1_P: J4.7(BMX1_P) J5.8 ; port UPA_MX1_P
UPA_MX2_N: J4.6(BMX2_N) J5.5 ; port UPA_MX2_N
UPA_MX2_P: J4.5(BMX2_P) J5.6 ; port UPA_MX2_P
UPA_MX3_N: J4.2(BMX3_N) J5.1 ; port UPA_MX3_N
UPA_MX3_P: J4.1(BMX3_P) J5.2 ; port UPA_MX3_P
UPA_MX4_N: J4.4(BMX4_N) J5.3 ; port UPA_MX4_N
UPA_MX4_P: J4.3(BMX4_P) J5.4 ; port UPA_MX4_P
UPBMX1_N: J3.14(AMX1_N) J6.8
UPBMX1_P: J3.13(AMX1_P) J6.7
UPBMX2_N: J3.12(AMX2_N) J6.6
UPBMX2_P: J3.11(AMX2_P) J6.5
UPBMX3_N: J3.10(AMX3_N) J6.2
UPBMX3_P: J3.9(AMX3_P) J6.1
UPBMX4_N: J3.16(AMX4_N) J6.4
UPBMX4_P: J3.15(AMX4_P) J6.3
UPC-AG+: J4.26(AGRE+) J5.17 ; port UPC-AG+
UPC-AG-: J4.25(AGRE-) J5.18 ; port UPC-AG-
UPC-AY+: J4.22(AYEL+) J5.15 ; port UPC-AY+
UPC-AY-: J4.21(AYEL-) J5.16 ; port UPC-AY-
UPC_MX1_N: J4.14(AMX1_N) J5.24 ; port UPC_MX1_N
UPC_MX1_P: J4.13(AMX1_P) J5.23 ; port UPC_MX1_P
UPC_MX2_N: J4.12(AMX2_N) J5.22 ; port UPC_MX2_N
UPC_MX2_P: J4.11(AMX2_P) J5.21 ; port UPC_MX2_P
UPC_MX3_N: J4.10(AMX3_N) J5.20 ; port UPC_MX3_N
UPC_MX3_P: J4.9(AMX3_P) J5.19 ; port UPC_MX3_P
UPC_MX4_N: J4.16(AMX4_N) J5.26 ; port UPC_MX4_N
UPC_MX4_P: J4.15(AMX4_P) J5.25 ; port UPC_MX4_P
UPG+: J3.26(AGRE+) J6.11
UPG-: J3.25(AGRE-) J6.12
UPY+: J3.22(AYEL+) J6.9
UPY-: J3.21(AYEL-) J6.10
NetJ2_19: J2.19(BYEL-) ; port BY-
NetJ2_20: J2.20(BYEL+) ; port BY+
NetJ2_21: J2.21(AYEL-) ; port AY-
NetJ2_22: J2.22(AYEL+) ; port AY+
NetJ2_23: J2.23(BGRE-) ; port BG-
NetJ2_24: J2.24(BGRE+) ; port BG+
NetJ2_25: J2.25(AGRE-) ; port AG-
NetJ2_26: J2.26(AGRE+) ; port AG+
NetJ3_19: J3.19(BYEL-) ; port CY-
NetJ3_20: J3.20(BYEL+) ; port CY+
NetJ3_23: J3.23(BGRE-) ; port CG-
NetJ3_24: J3.24(BGRE+) ; port CG+
NetJ6_18: J6.18 ; port G5_PWR_EN
NetJ6_19: J6.19 ; port G5_UART_RX
NetJ6_20: J6.20 ; port G5_UART_TX
NetJ6_21: J6.21 ; port G4_PWR_EN
NetJ6_22: J6.22 ; port G4_UART_TX
NetJ6_23: J6.23 ; port G4_UART_RX
NetJ6_24: J6.24 ; port G3_PWR_EN
NetJ6_25: J6.25 ; port G3_UART_TX
NetJ6_26: J6.26 ; port G3_UART_RX

Not connected (* = marked no-connect by the designer): J8 15(14) 16(14) 17(14) 18(14) 23(14) 24(14); M1 1; M2 1; M3 1; M4 1; M5 1; M6 1; M7 1; M8 1

### Notes on the sheet
- (in symbol GOSPELL) Title:; Rev:; Copyright:; Circuit:; Engineer:; Size:; Date:; Modify Date:; Sheet#:; out of:

### Library data of the parts
J2-J4 = CON26A_0
M1-M8 = GEN35: Layer: Top; SMD: No; DEVICE: HOLE-8STARS
*#4 = GOSPELL: Page Number: 9; Cage Code: 2017; Schematic Page Count: 9; Schematic Page Number: 9

## Sheet P08 PHY 3.SchDoc
size 420 x 297 mm
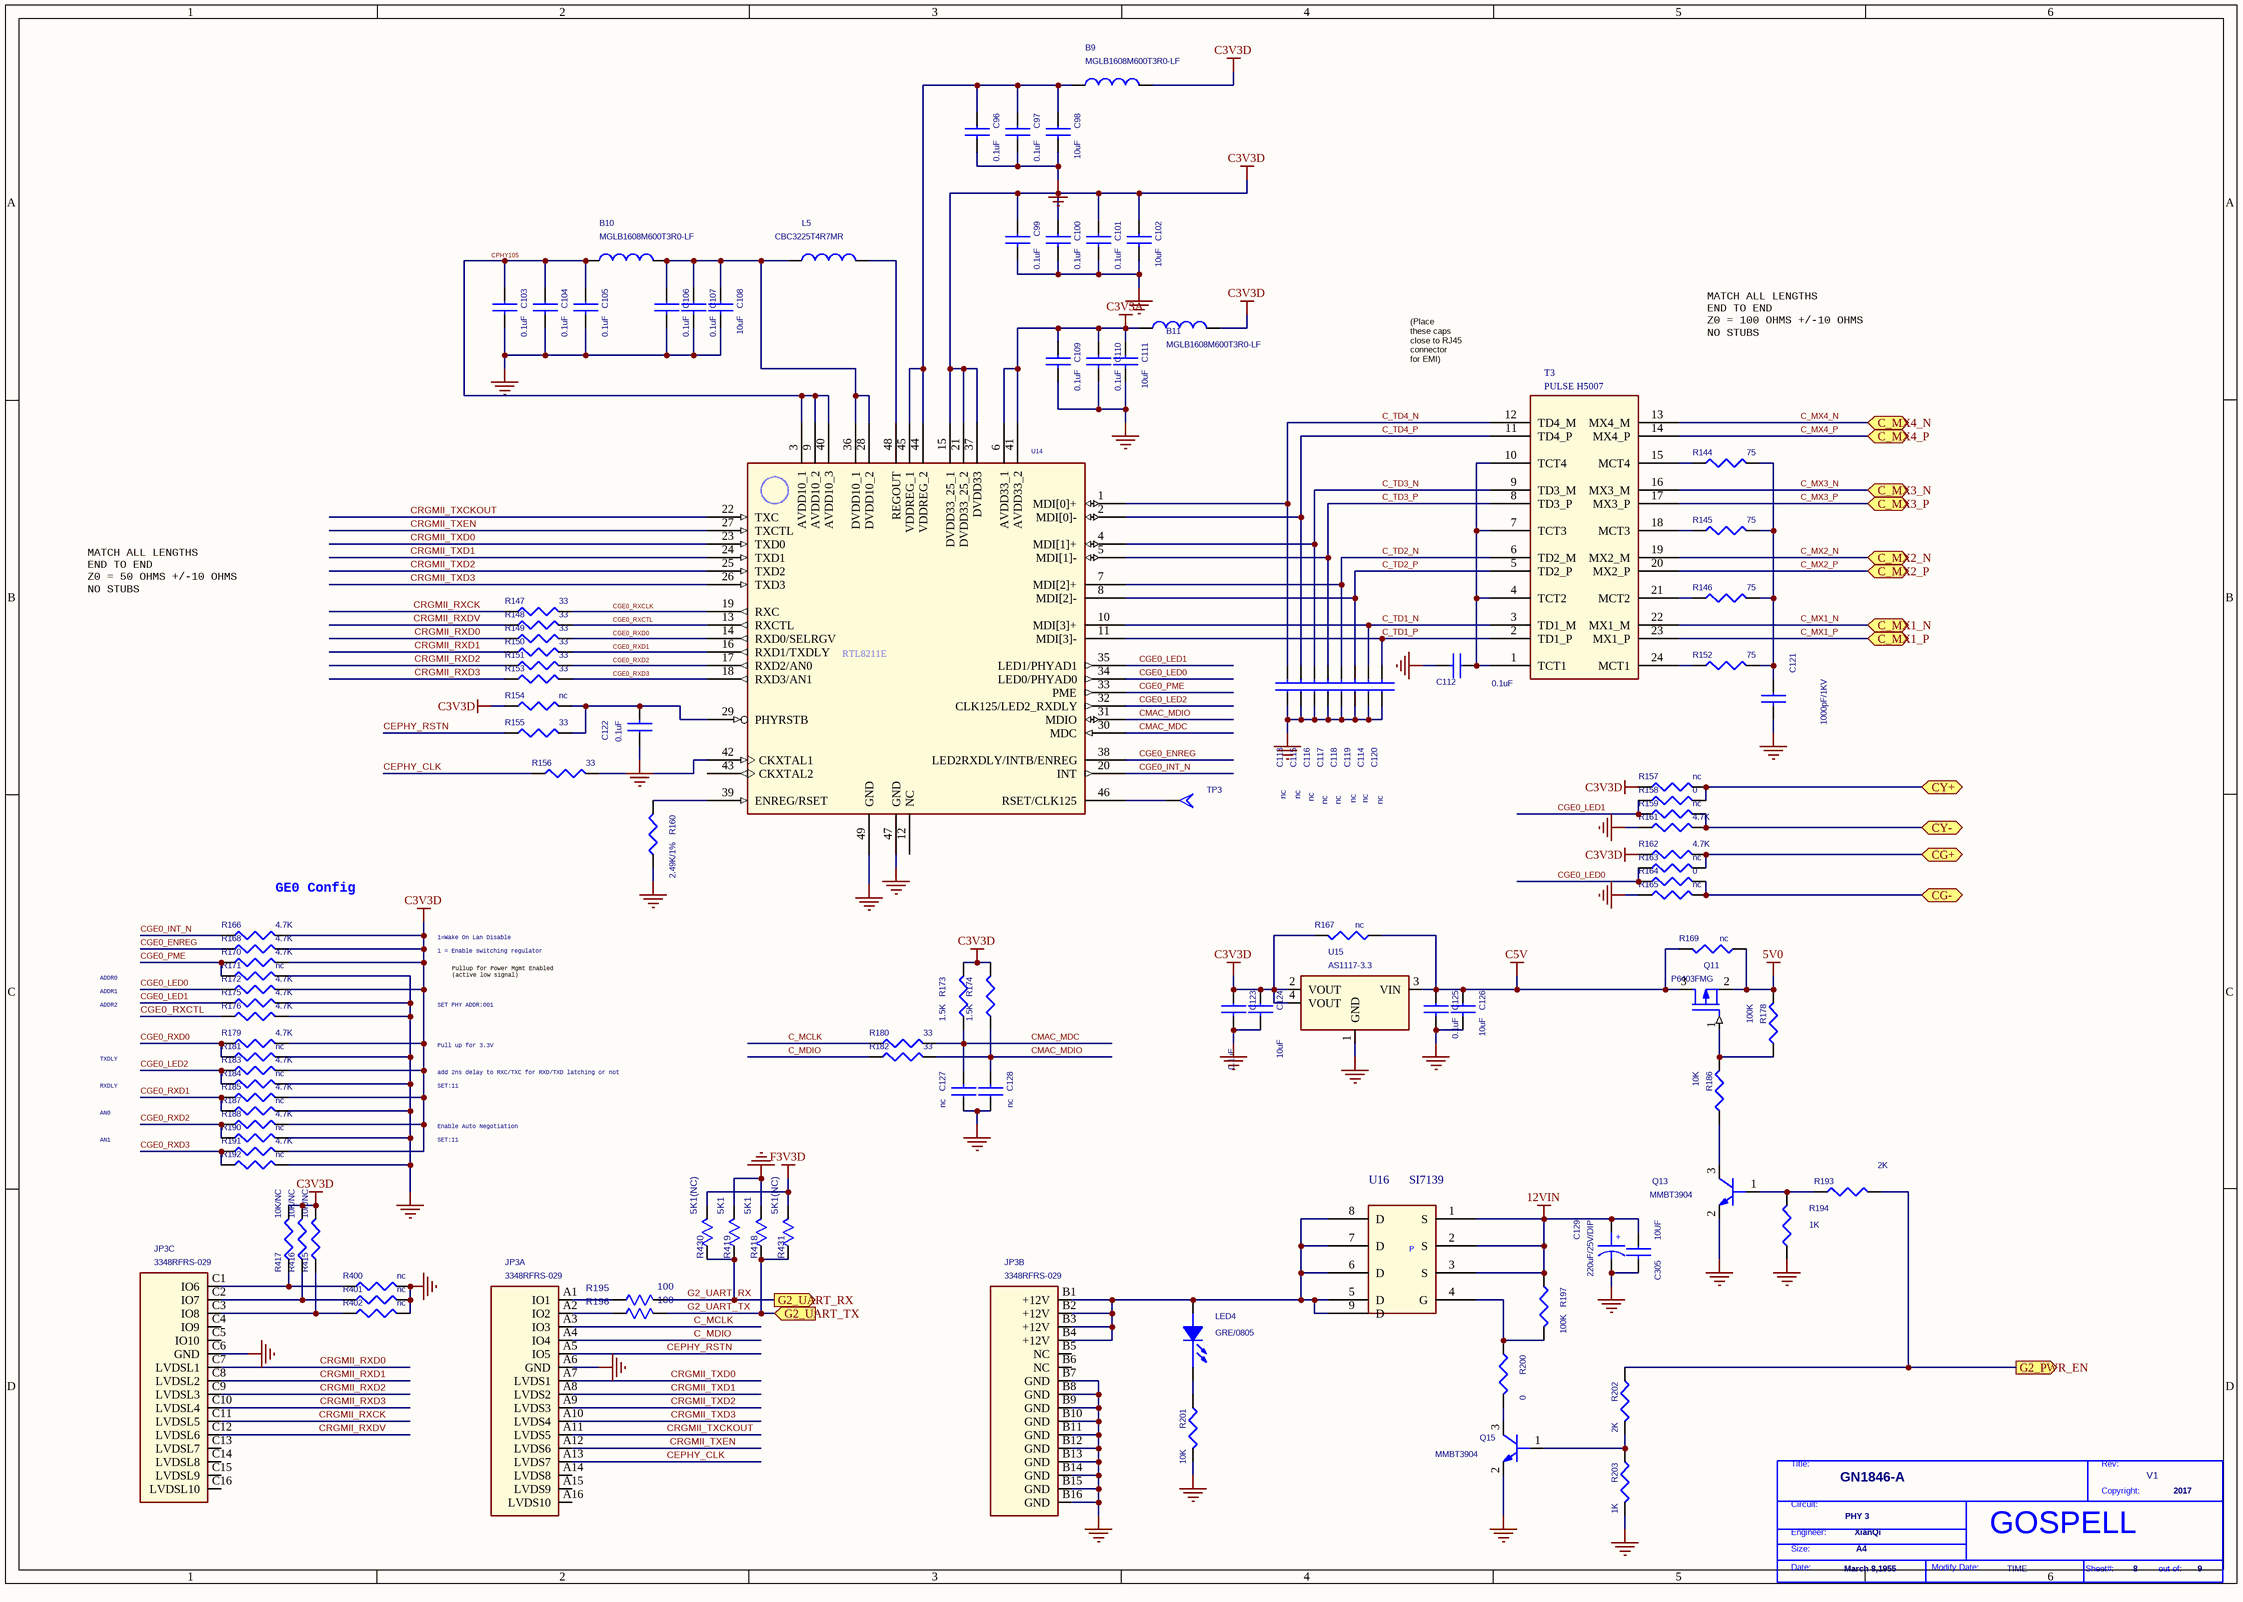
[diagram p4: P08 PHY 3.SchDoc]

### Parts
(Parts that share a designator on the sheet are numbered #1, #2 ... from top to bottom, then left to right.)
*#5  Doc: PHY 3  Page Count: 9  Page Number: 8  Page Create Date: March 8,1955  Page Size: A4  RevCode: V1  Title: GN1846-A  Copyright: 2017  Engineer: XianQi  Page Modify Date: TIME  (hidden comment: GOSPELL)  (graphical)
B9  MGLB1608M600T3R0-LF  [L0603]
B10  MGLB1608M600T3R0-LF  [L0603]
B11  MGLB1608M600T3R0-LF  [L0603]
C96  0.1uF  [0402C]
C97  0.1uF  [0402C]
C98  10uF  [C0603]
C99  0.1uF  [0402C]
C100  0.1uF  [0402C]
C101  0.1uF  [0402C]
C102  10uF  [C0603]
C103  0.1uF  [0402C]
C104  0.1uF  [0402C]
C105  0.1uF  [0402C]
C106  0.1uF  [0402C]
C107  0.1uF  [0402C]
C108  10uF  [C0603]
C109  0.1uF  [0402C]
C110  0.1uF  [0402C]
C111  10uF  [C0603]
C112  0.1uF  [0402C]
C113  nc  [0402C]
C114  nc  [0402C]
C115  nc  [0402C]
C116  nc  [0402C]
C117  nc  [0402C]
C118  nc  [0402C]
C119  nc  [0402C]
C120  nc  [0402C]
C121  1000pF/1KV  [C1206]
C122  0.1uF  [0402C]
C123  0.1uF  [0402C]
C124  10uF  [C0603]
C125  0.1uF  [0402C]
C126  10uF  [C0603]
C127  nc  [0402C]
C128  nc  [0402C]
C129  220uF/25V/DIP  [CE8X3.5]
C305  10UF  [C1206]
JP3  3348RFRS-029  [3348RFRS-029]  (parts A,B,C of 3)
L5  CBC3225T4R7MR  [FB0805]
LED4  GRE/0805  [LED0805]
Q11  P6403FMG  [SOT23]
Q13  MMBT3904  [SOT23]
Q15  MMBT3904  [SOT23]
R144  75  [0402R]
R145  75  [0402R]
R146  75  [0402R]
R147  33  [0402R]
R148  33  [0402R]
R149  33  [0402R]
R150  33  [0402R]
R151  33  [0402R]
R152  75  [0402R]
R153  33  [0402R]
R154  nc  [0402R]
R155  33  [0402R]
R156  33  [0402R]
R157  nc  [0402R]
R158  0  [0402R]
R159  nc  [0402R]
R160  2.49K/1%  [0402R]
R161  4.7K  [0402R]
R162  4.7K  [0402R]
R163  nc  [0402R]
R164  0  [0402R]
R165  nc  [0402R]
R166  4.7K  [0402R]
R167  nc  [R0603]
R168  4.7K  [0402R]
R169  nc  [R0603]
R170  4.7K  [0402R]
R171  nc  [0402R]
R172  4.7K  [0402R]
R173  1.5K  [0402R]
R174  1.5K  [0402R]
R175  4.7K  [0402R]
R176  4.7K  [0402R]
R178  100K  [0402R]
R179  4.7K  [0402R]
R180  33  [0402R]
R181  nc  [0402R]
R182  33  [0402R]
R183  4.7K  [0402R]
R184  nc  [0402R]
R185  4.7K  [0402R]
R186  10K  [0402R]
R187  nc  [0402R]
R188  4.7K  [0402R]
R190  nc  [0402R]
R191  4.7K  [0402R]
R192  nc  [0402R]
R193  2K  [0402R]
R194  1K  [0402R]
R195  100  [0402R]
R196  100  [0402R]
R197  100K  [R0603]
R200  0  [0402R]
R201  10K  [0402R]
R202  2K  [0402R]
R203  1K  [0402R]
R400  nc  [0402R]
R401  nc  [0402R]
R402  nc  [0402R]
R415  10K/NC  [0402R]
R416  10K/NC  [0402R]
R417  10K/NC  [0402R]
R418  5K1  [0402R]
R419  5K1  [0402R]
R430  5K1(NC)  [0402R]
R431  5K1(NC)  [0402R]
T3  PULSE H5007  [H5007-H]
TP3  T POINT A  [TP_G]  (value not drawn)
U14  RTL8211D  [QFN-48P-RTL8211]  (value not drawn)
U15  AS1117-3.3  [SOT223]
U16  SI7139  [PowerPAKSO8]

### Ports
C_MX1_N (bidir), C_MX1_P (bidir), C_MX2_N (bidir), C_MX2_P (bidir), C_MX3_N (bidir), C_MX3_P (bidir), C_MX4_N (bidir), C_MX4_P (bidir), CG+ (bidir), CG- (bidir), CY+ (bidir), CY- (bidir), G2_PWR_EN (out), G2_UART_RX (out), G2_UART_TX (in)

### Nets
5V0: Q11.2(SOURCE) R169.2 R178.1
12VIN: C129.1 C305.1 R197.2 U16.1(S) U16.2(S) U16.3(S)
C3V3A: B11.1 C109.1 C110.1 C111.1 U14.6(AVDD33_1) U14.41(AVDD33_2)
C3V3D: B9.2 B11.2 C99.1 C100.1 C101.1 C102.1 C123.1 C124.1 R154.1 R157.1 R162.1 R166.2 R167.1 R168.2 R170.2 R172.2 R173.2 R174.2 R179.2 R183.2 R185.2 R188.2 R191.2 R415.2 R416.2 R417.2 U14.15(DVDD33_25_1) U14.21(DVDD33_25_2) U14.37(DVDD33) U15.2(VOUT) U15.4(VOUT)
C5V: C125.1 C126.1 Q11.3(DRAIN) R167.2 R169.1 U15.3(VIN)
F3V3D: R430.2(B) R431.2(B)
GND: C96.2 C97.2 C98.2 C99.2 C100.2 C101.2 C102.2 C103.2 C104.2 C105.2 C106.2 C107.2 C108.2 C109.2 C110.2 C111.2 C112.2 C113.1 C114.1 C115.1 C116.1 C117.1 C118.1 C119.1 C120.1 C121.2 C122.1 C123.2 C124.2 C125.2 C126.2 C127.1 C128.1 C129.2 C305.2 JP3.A6(GND) JP3.B7(GND) JP3.B8(GND) JP3.B9(GND) JP3.B10(GND) JP3.B11(GND) JP3.B12(GND) JP3.B13(GND) JP3.B14(GND) JP3.B15(GND) JP3.B16(GND) JP3.C6(GND) Q13.2(EMITTER) Q15.2(EMITTER) R160.1 R161.1 R165.1 R171.2 R175.2 R176.2 R181.2 R184.2 R187.2 R190.2 R192.2 R194.1 R201.1 R203.1 R400.2 R401.2 R402.2 R418.2(B) R419.2(B) U14.47(GND) U14.49(GND) U15.1(GND)
C_MCLK: JP3.A3(IO3) R180.1
C_MDIO: JP3.A4(IO4) R182.1
C_MX1_N: T3.22(MX1_M) ; port C_MX1_N
C_MX1_P: T3.23(MX1_P) ; port C_MX1_P
C_MX2_N: T3.19(MX2_M) ; port C_MX2_N
C_MX2_P: T3.20(MX2_P) ; port C_MX2_P
C_MX3_N: T3.16(MX3_M) ; port C_MX3_N
C_MX3_P: T3.17(MX3_P) ; port C_MX3_P
C_MX4_N: T3.13(MX4_M) ; port C_MX4_N
C_MX4_P: T3.14(MX4_P) ; port C_MX4_P
C_TD1_N: C114.2 T3.3(TD1_M) U14.10(MDI[3]+)
C_TD1_P: C120.2 T3.2(TD1_P) U14.11(MDI[3]-)
C_TD2_N: C118.2 T3.6(TD2_M) U14.7(MDI[2]+)
C_TD2_P: C119.2 T3.5(TD2_P) U14.8(MDI[2]-)
C_TD3_N: C116.2 T3.9(TD3_M) U14.4(MDI[1]+)
C_TD3_P: C117.2 T3.8(TD3_P) U14.5(MDI[1]-)
C_TD4_N: C113.2 T3.12(TD4_M) U14.1(MDI[0]+)
C_TD4_P: C115.2 T3.11(TD4_P) U14.2(MDI[0]-)
CEPHY_CLK: JP3.A13(LVDS7) R156.1
CEPHY_RSTN: JP3.A5(IO5) R155.1
CGE0_ENREG: R168.1 U14.38(LED2RXDLY/INTB/ENREG)
CGE0_INT_N: R166.1 U14.20(INT)
CGE0_LED0: R163.1 R164.1 R172.1 U14.34(LED0/PHYAD0)
CGE0_LED1: R158.1 R159.1 R175.1 U14.35(LED1/PHYAD1)
CGE0_LED2: R183.1 R184.1 U14.32(CLK125/LED2_RXDLY)
CGE0_PME: R170.1 R171.1 U14.33(PME)
CGE0_RXCLK: R147.2 U14.19(RXC)
CGE0_RXCTL: R148.2 R176.1 U14.13(RXCTL)
CGE0_RXD0: R149.2 R179.1 R181.1 U14.14(RXD0/SELRGV)
CGE0_RXD1: R150.2 R185.1 R187.1 U14.16(RXD1/TXDLY)
CGE0_RXD2: R151.2 R188.1 R190.1 U14.17(RXD2/AN0)
CGE0_RXD3: R153.2 R191.1 R192.1 U14.18(RXD3/AN1)
CMAC_MDC: C127.2 R173.1 R180.2 U14.30(MDC)
CMAC_MDIO: C128.2 R174.1 R182.2 U14.31(MDIO)
CPHY105: B10.1 C103.1 C104.1 C105.1 U14.3(AVDD10_1) U14.9(AVDD10_2) U14.40(AVDD10_3)
CRGMII_RXCK: JP3.C11(LVDSL5) R147.1
CRGMII_RXD0: JP3.C7(LVDSL1) R149.1
CRGMII_RXD1: JP3.C8(LVDSL2) R150.1
CRGMII_RXD2: JP3.C9(LVDSL3) R151.1
CRGMII_RXD3: JP3.C10(LVDSL4) R153.1
CRGMII_RXDV: JP3.C12(LVDSL6) R148.1
CRGMII_TXCKOUT: JP3.A11(LVDS5) U14.22(TXC)
CRGMII_TXD0: JP3.A7(LVDS1) U14.23(TXD0)
CRGMII_TXD1: JP3.A8(LVDS2) U14.24(TXD1)
CRGMII_TXD2: JP3.A9(LVDS3) U14.25(TXD2)
CRGMII_TXD3: JP3.A10(LVDS4) U14.26(TXD3)
CRGMII_TXEN: JP3.A12(LVDS6) U14.27(TXCTL)
G2_UART_RX: R195.2(B) R419.1(A) R430.1(A) ; port G2_UART_RX
G2_UART_TX: R196.2(B) R418.1(A) R431.1(A) ; port G2_UART_TX
NetB9_1: B9.1 C96.1 C97.1 C98.1 U14.44(VDDREG_2) U14.45(VDDREG_1)
NetB10_2: B10.2 C106.1 C107.1 C108.1 L5.1 U14.28(DVDD10_2) U14.36(DVDD10_1)
NetC112_1: C112.1 T3.1(TCT1) T3.4(TCT2) T3.7(TCT3) T3.10(TCT4)
NetC121_1: C121.1 R144.2 R145.2 R146.2 R152.2
NetC122_2: C122.2 R154.2 R155.2 U14.29(PHYRSTB)
NetJ3_19: R159.2 R161.2 ; port CY-
NetJ3_20: R157.2 R158.2 ; port CY+
NetJ3_23: R164.2 R165.2 ; port CG-
NetJ3_24: R162.2 R163.2 ; port CG+
NetJP3_A1: JP3.A1(IO1) R195.1(A)
NetJP3_A2: JP3.A2(IO2) R196.1(A)
NetJP3_B1: JP3.B1(+12V) JP3.B2(+12V) JP3.B3(+12V) JP3.B4(+12V) LED4.A(ANODE) U16.5(D) U16.6(D) U16.7(D) U16.8(D) U16.9(D)
NetJP3_C1: JP3.C1(IO6) R400.1 R417.1
NetJP3_C2: JP3.C2(IO7) R401.1 R416.1
NetJP3_C3: JP3.C3(IO8) R402.1 R415.1
NetL5_2: L5.2 U14.48(REGOUT)
NetLED4_K: LED4.K(CATHODE) R201.2
NetQ11_1: Q11.1(GATE) R178.2 R186.1
NetQ13_1: Q13.1(BASE) R193.1 R194.2
NetQ13_3: Q13.3(COLLECTOR) R186.2
NetQ15_1: Q15.1(BASE) R202.1 R203.2
NetQ15_3: Q15.3(COLLECTOR) R200.1
NetR144_1: R144.1 T3.15(MCT4)
NetR145_1: R145.1 T3.18(MCT3)
NetR146_1: R146.1 T3.21(MCT2)
NetR152_1: R152.1 T3.24(MCT1)
NetR156_2: R156.2 U14.42(CKXTAL1)
NetR160_2: R160.2 U14.39(ENREG/RSET)
NetR193_2: R193.2 R202.2 ; port G2_PWR_EN
NetR197_1: R197.1 R200.2 U16.4(G)
NetTP3_1: TP3.1(TP) U14.46(RSET/CLK125)

Not connected (* = marked no-connect by the designer): JP3 A14(LVDS8) A15(LVDS9) A16(LVDS10) B5(NC) B6(NC) C4(IO9) C5(IO10) C13(LVDSL7) C14(LVDSL8) C15(LVDSL9) C16(LVDSL10); U14 12(NC) 43(CKXTAL2)

### Notes on the sheet
- (Place
  these caps
  close to RJ45
  connector
  for EMI)
- MATCH ALL LENGTHS
  END TO END
  Z0 = 100 OHMS +/-10 OHMS
  NO STUBS
- MATCH ALL LENGTHS
  END TO END
  Z0 = 50 OHMS +/-10 OHMS
  NO STUBS
- GE0 Config
- 1=Wake On Lan Disable
- ADDR0
- ADDR1
- 1 = Enable switching regulator
- Pullup for Power Mgmt Enabled
  (active low signal)
- ADDR2
- TXDLY
- SET PHY ADDR:001
- Pull up for 3.3V
- add 2ns delay to RXC/TXC for RXD/TXD latching or not
- AN0
- RXDLY
- Enable Auto Negotiation
- SET:11
- AN1
- (in symbol CAP POL) +
- (in symbol GOSPELL) Title:; Rev:; Copyright:; Circuit:; Engineer:; Size:; Date:; Modify Date:; Sheet#:; out of:
- (in symbol RTL8211D_1) RTL8211E
- (in symbol SI7139) P

### Library data of the parts
B9-B11 L5 = CHOKE TORROID_0
C96-C128 = CAP NP_Dup1
C129 = CAP POL
C305 = CAP NP
LED4 = LED_0
Q11 = MOSFET P_0
Q13 Q15 = 2N3904
R144-R166 R168 R170-R176 R179-R185 R187 R188 R190-R192 R197 R200-R203 R400-R402 R415-R417 = R_Dup1
R167 R169 R178 R186 R193 R194 = R
R195 R196 R418 R419 R430 R431 = R_1: as R135 on sheet P07 PHY 2
T3 = PULSE H5007_0
U14 = RTL8211D_1
U15 = AS1117-X_2
*#5 = GOSPELL: Cage Code: 2017; Schematic Page Count: 9; Schematic Page Number: 8

## Sheet P06 PHY 1.SchDoc
size 420 x 297 mm
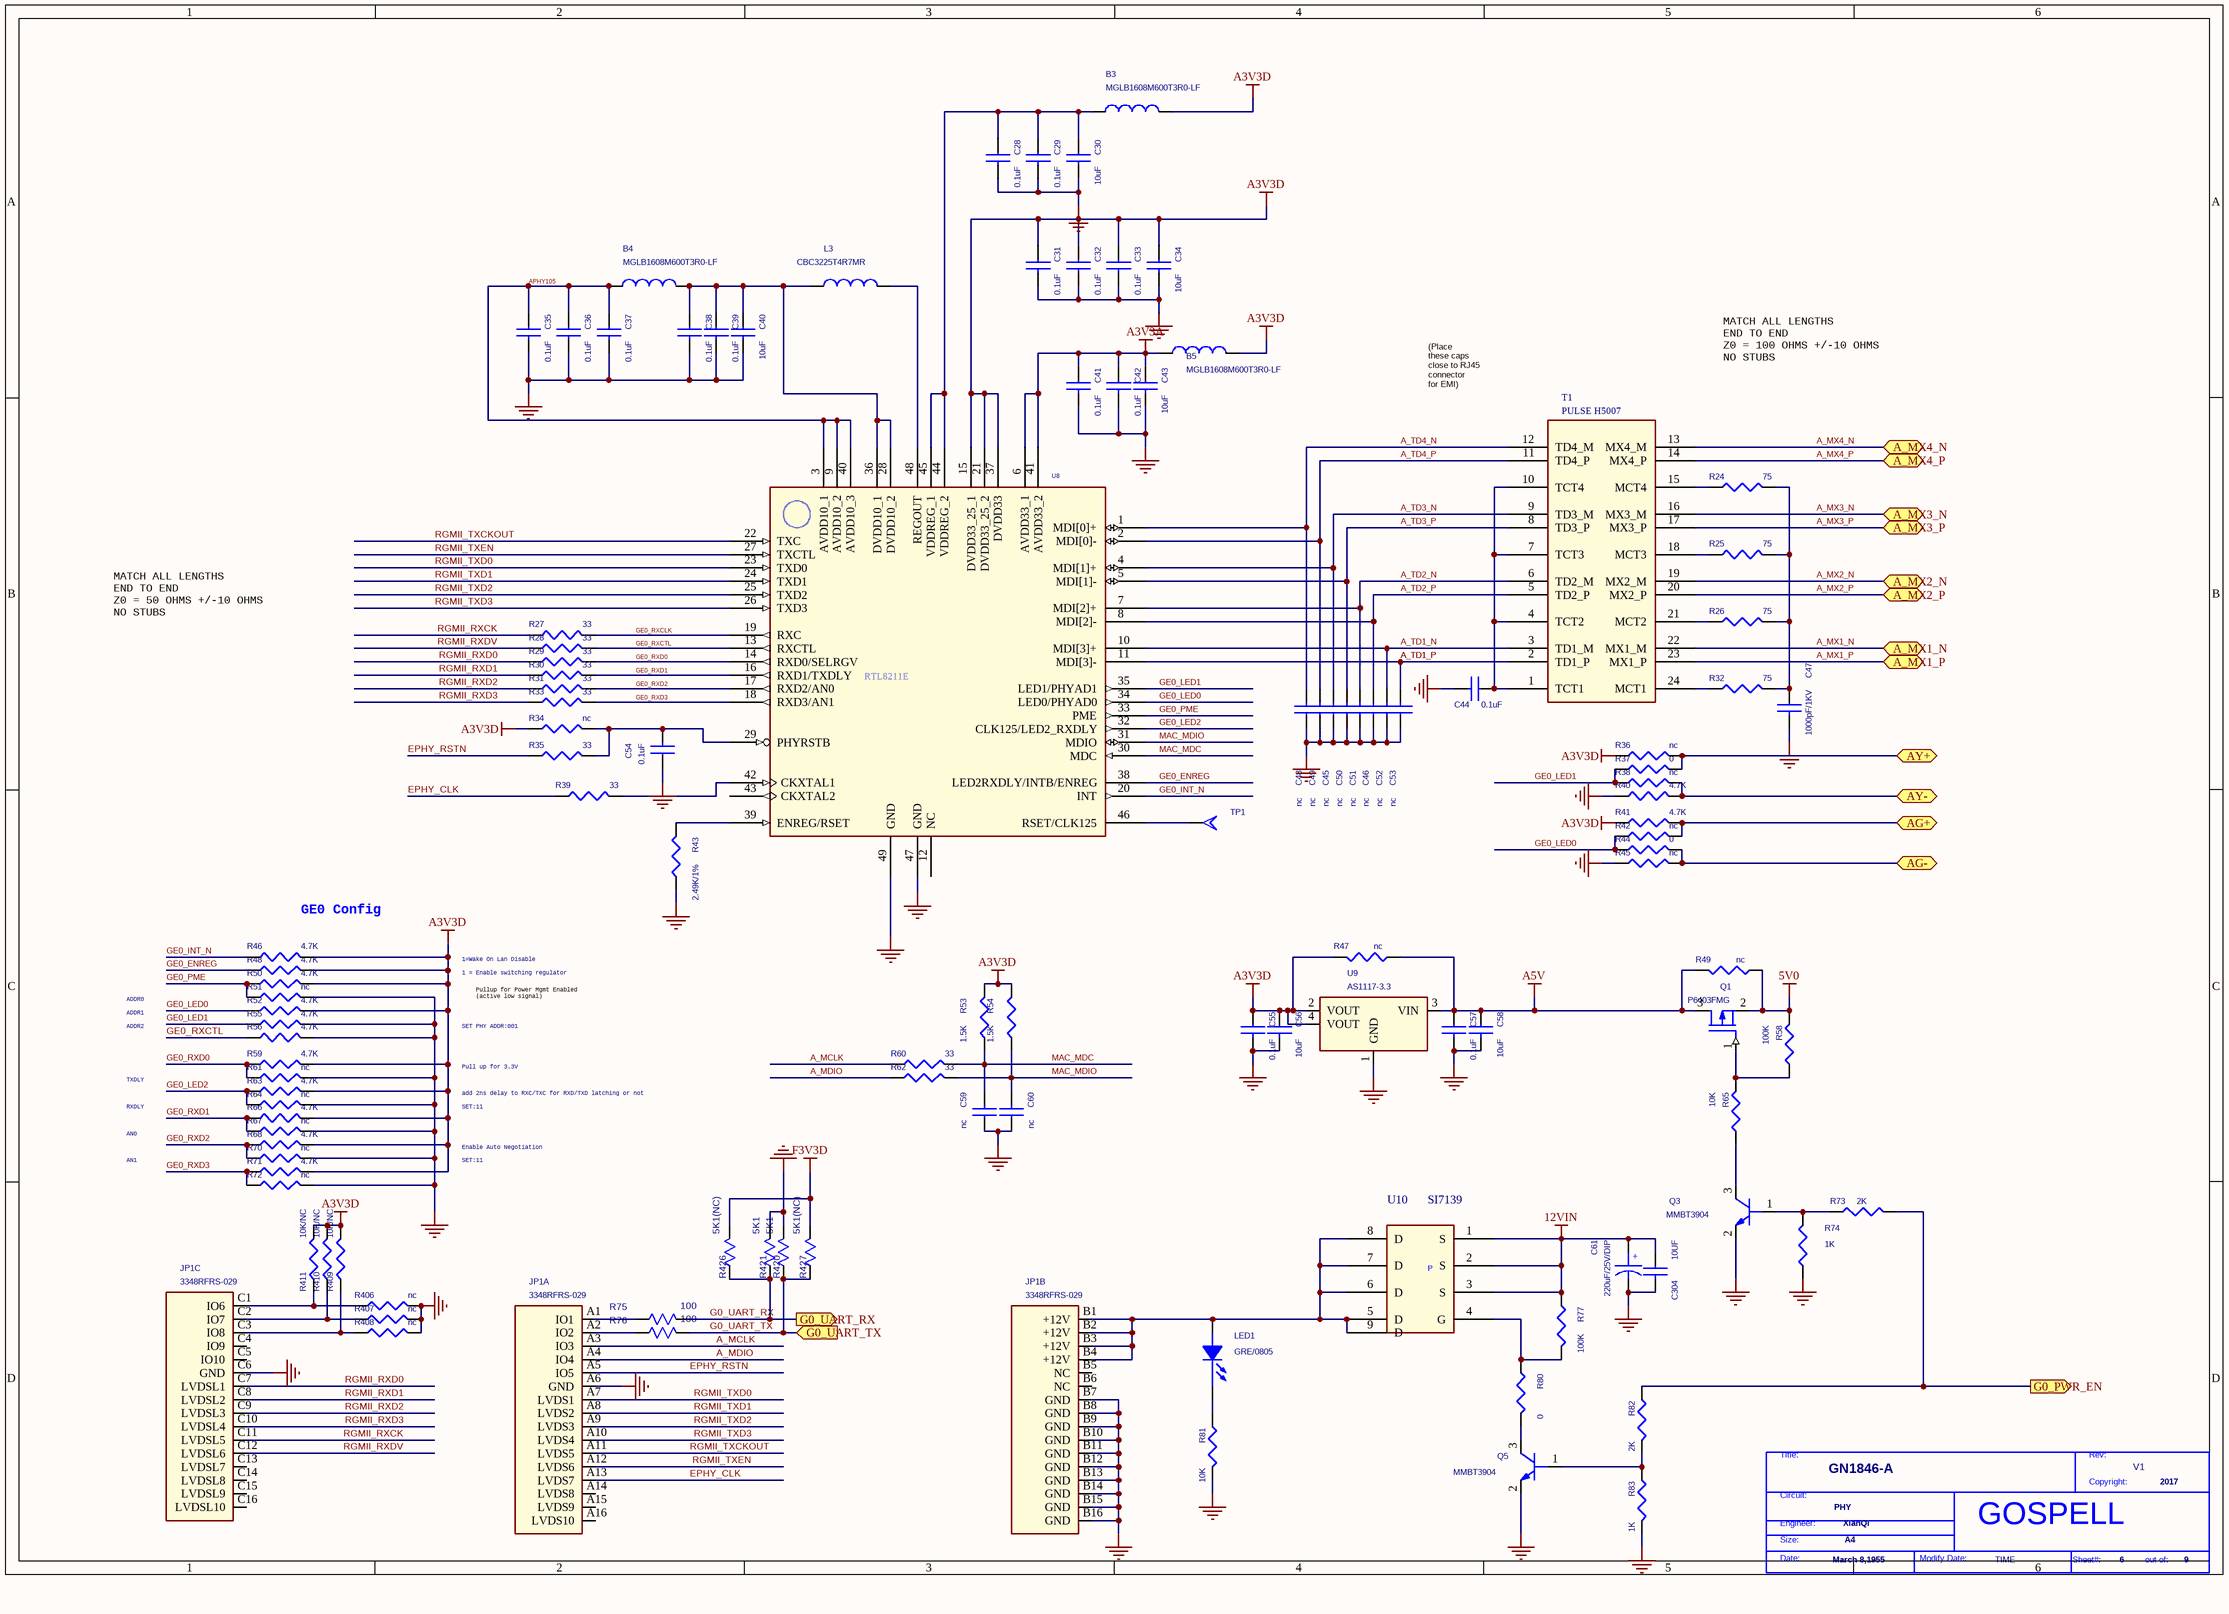
[diagram p5: P06 PHY 1.SchDoc]

### Parts
(Parts that share a designator on the sheet are numbered #1, #2 ... from top to bottom, then left to right.)
*#6  Doc: PHY  Page Count: 9  Page Number: 6  Page Create Date: March 8,1955  Page Size: A4  RevCode: V1  Title: GN1846-A  Copyright: 2017  Engineer: XianQi  Page Modify Date: TIME  (hidden comment: GOSPELL)  (graphical)
B3  MGLB1608M600T3R0-LF  [L0603]
B4  MGLB1608M600T3R0-LF  [L0603]
B5  MGLB1608M600T3R0-LF  [L0603]
C28  0.1uF  [0402C]
C29  0.1uF  [0402C]
C30  10uF  [C0603]
C31  0.1uF  [0402C]
C32  0.1uF  [0402C]
C33  0.1uF  [0402C]
C34  10uF  [C0603]
C35  0.1uF  [0402C]
C36  0.1uF  [0402C]
C37  0.1uF  [0402C]
C38  0.1uF  [0402C]
C39  0.1uF  [0402C]
C40  10uF  [C0603]
C41  0.1uF  [0402C]
C42  0.1uF  [0402C]
C43  10uF  [C0603]
C44  0.1uF  [0402C]
C45  nc  [0402C]
C46  nc  [0402C]
C47  1000pF/1KV  [C1206]
C48  nc  [0402C]
C49  nc  [0402C]
C50  nc  [0402C]
C51  nc  [0402C]
C52  nc  [0402C]
C53  nc  [0402C]
C54  0.1uF  [0402C]
C55  0.1uF  [0402C]
C56  10uF  [C0603]
C57  0.1uF  [0402C]
C58  10uF  [C0603]
C59  nc  [0402C]
C60  nc  [0402C]
C61  220uF/25V/DIP  [CE8X3.5]
C304  10UF  [C1206]
JP1  3348RFRS-029  [3348RFRS-029]  (parts A,B,C of 3)
L3  CBC3225T4R7MR  [FB0805]
LED1  GRE/0805  [LED0805]
Q1  P6403FMG  [SOT23]
Q3  MMBT3904  [SOT23]
Q5  MMBT3904  [SOT23]
R24  75  [0402R]
R25  75  [0402R]
R26  75  [0402R]
R27  33  [0402R]
R28  33  [0402R]
R29  33  [0402R]
R30  33  [0402R]
R31  33  [0402R]
R32  75  [0402R]
R33  33  [0402R]
R34  nc  [0402R]
R35  33  [0402R]
R36  nc  [0402R]
R37  0  [0402R]
R38  nc  [0402R]
R39  33  [0402R]
R40  4.7K  [0402R]
R41  4.7K  [0402R]
R42  nc  [0402R]
R43  2.49K/1%  [0402R]
R44  0  [0402R]
R45  nc  [0402R]
R46  4.7K  [0402R]
R47  nc  [R0603]
R48  4.7K  [0402R]
R49  nc  [R0603]
R50  4.7K  [0402R]
R51  nc  [0402R]
R52  4.7K  [0402R]
R53  1.5K  [0402R]
R54  1.5K  [0402R]
R55  4.7K  [0402R]
R56  4.7K  [0402R]
R58  100K  [0402R]
R59  4.7K  [0402R]
R60  33  [0402R]
R61  nc  [0402R]
R62  33  [0402R]
R63  4.7K  [0402R]
R64  nc  [0402R]
R65  10K  [0402R]
R66  4.7K  [0402R]
R67  nc  [0402R]
R68  4.7K  [0402R]
R70  nc  [0402R]
R71  4.7K  [0402R]
R72  nc  [0402R]
R73  2K  [0402R]
R74  1K  [0402R]
R75  100  [0402R]
R76  100  [0402R]
R77  100K  [R0603]
R80  0  [0402R]
R81  10K  [0402R]
R82  2K  [0402R]
R83  1K  [0402R]
R406  nc  [0402R]
R407  nc  [0402R]
R408  nc  [0402R]
R409  10K/NC  [0402R]
R410  10K/NC  [0402R]
R411  10K/NC  [0402R]
R420  5K1  [0402R]
R421  5K1  [0402R]
R426  5K1(NC)  [0402R]
R427  5K1(NC)  [0402R]
T1  PULSE H5007  [H5007-H]
TP1  T POINT A  [TP_G]  (value not drawn)
U8  RTL8211D  [QFN-48P-RTL8211]  (value not drawn)
U9  AS1117-3.3  [SOT223]
U10  SI7139  [PowerPAKSO8]

### Ports
A_MX1_N (bidir), A_MX1_P (bidir), A_MX2_N (bidir), A_MX2_P (bidir), A_MX3_N (bidir), A_MX3_P (bidir), A_MX4_N (bidir), A_MX4_P (bidir), AG+ (bidir), AG- (bidir), AY+ (bidir), AY- (bidir), G0_PWR_EN (out), G0_UART_RX (out), G0_UART_TX (in)

### Nets
5V0: Q1.2(SOURCE) R49.2 R58.1
12VIN: C61.1 C304.1 R77.2 U10.1(S) U10.2(S) U10.3(S)
A3V3A: B5.1 C41.1 C42.1 C43.1 U8.6(AVDD33_1) U8.41(AVDD33_2)
A3V3D: B3.2 B5.2 C31.1 C32.1 C33.1 C34.1 C55.1 C56.1 R34.1 R36.1 R41.1 R46.2 R47.1 R48.2 R50.2 R52.2 R53.2 R54.2 R59.2 R63.2 R66.2 R68.2 R71.2 R409.2 R410.2 R411.2 U8.15(DVDD33_25_1) U8.21(DVDD33_25_2) U8.37(DVDD33) U9.2(VOUT) U9.4(VOUT)
A5V: C57.1 C58.1 Q1.3(DRAIN) R47.2 R49.1 U9.3(VIN)
F3V3D: R426.2(B) R427.2(B)
GND: C28.2 C29.2 C30.2 C31.2 C32.2 C33.2 C34.2 C35.2 C36.2 C37.2 C38.2 C39.2 C40.2 C41.2 C42.2 C43.2 C44.2 C45.1 C46.1 C47.2 C48.1 C49.1 C50.1 C51.1 C52.1 C53.1 C54.1 C55.2 C56.2 C57.2 C58.2 C59.1 C60.1 C61.2 C304.2 JP1.A6(GND) JP1.B7(GND) JP1.B8(GND) JP1.B9(GND) JP1.B10(GND) JP1.B11(GND) JP1.B12(GND) JP1.B13(GND) JP1.B14(GND) JP1.B15(GND) JP1.B16(GND) JP1.C6(GND) Q3.2(EMITTER) Q5.2(EMITTER) R40.1 R43.1 R45.1 R51.2 R55.2 R56.2 R61.2 R64.2 R67.2 R70.2 R72.2 R74.1 R81.1 R83.1 R406.2 R407.2 R408.2 R420.2(B) R421.2(B) U8.47(GND) U8.49(GND) U9.1(GND)
A_MCLK: JP1.A3(IO3) R60.1
A_MDIO: JP1.A4(IO4) R62.1
A_MX1_N: T1.22(MX1_M) ; port A_MX1_N
A_MX1_P: T1.23(MX1_P) ; port A_MX1_P
A_MX2_N: T1.19(MX2_M) ; port A_MX2_N
A_MX2_P: T1.20(MX2_P) ; port A_MX2_P
A_MX3_N: T1.16(MX3_M) ; port A_MX3_N
A_MX3_P: T1.17(MX3_P) ; port A_MX3_P
A_MX4_N: T1.13(MX4_M) ; port A_MX4_N
A_MX4_P: T1.14(MX4_P) ; port A_MX4_P
A_TD1_N: C52.2 T1.3(TD1_M) U8.10(MDI[3]+)
A_TD1_P: C53.2 T1.2(TD1_P) U8.11(MDI[3]-)
A_TD2_N: C51.2 T1.6(TD2_M) U8.7(MDI[2]+)
A_TD2_P: C46.2 T1.5(TD2_P) U8.8(MDI[2]-)
A_TD3_N: C45.2 T1.9(TD3_M) U8.4(MDI[1]+)
A_TD3_P: C50.2 T1.8(TD3_P) U8.5(MDI[1]-)
A_TD4_N: C48.2 T1.12(TD4_M) U8.1(MDI[0]+)
A_TD4_P: C49.2 T1.11(TD4_P) U8.2(MDI[0]-)
APHY105: B4.1 C35.1 C36.1 C37.1 U8.3(AVDD10_1) U8.9(AVDD10_2) U8.40(AVDD10_3)
EPHY_CLK: JP1.A13(LVDS7) R39.1
EPHY_RSTN: JP1.A5(IO5) R35.1
G0_UART_RX: R75.2(B) R421.1(A) R426.1(A) ; port G0_UART_RX
G0_UART_TX: R76.2(B) R420.1(A) R427.1(A) ; port G0_UART_TX
GE0_ENREG: R48.1 U8.38(LED2RXDLY/INTB/ENREG)
GE0_INT_N: R46.1 U8.20(INT)
GE0_LED0: R42.1 R44.1 R52.1 U8.34(LED0/PHYAD0)
GE0_LED1: R37.1 R38.1 R55.1 U8.35(LED1/PHYAD1)
GE0_LED2: R63.1 R64.1 U8.32(CLK125/LED2_RXDLY)
GE0_PME: R50.1 R51.1 U8.33(PME)
GE0_RXCLK: R27.2 U8.19(RXC)
GE0_RXCTL: R28.2 R56.1 U8.13(RXCTL)
GE0_RXD0: R29.2 R59.1 R61.1 U8.14(RXD0/SELRGV)
GE0_RXD1: R30.2 R66.1 R67.1 U8.16(RXD1/TXDLY)
GE0_RXD2: R31.2 R68.1 R70.1 U8.17(RXD2/AN0)
GE0_RXD3: R33.2 R71.1 R72.1 U8.18(RXD3/AN1)
MAC_MDC: C59.2 R53.1 R60.2 U8.30(MDC)
MAC_MDIO: C60.2 R54.1 R62.2 U8.31(MDIO)
RGMII_RXCK: JP1.C11(LVDSL5) R27.1
RGMII_RXD0: JP1.C7(LVDSL1) R29.1
RGMII_RXD1: JP1.C8(LVDSL2) R30.1
RGMII_RXD2: JP1.C9(LVDSL3) R31.1
RGMII_RXD3: JP1.C10(LVDSL4) R33.1
RGMII_RXDV: JP1.C12(LVDSL6) R28.1
RGMII_TXCKOUT: JP1.A11(LVDS5) U8.22(TXC)
RGMII_TXD0: JP1.A7(LVDS1) U8.23(TXD0)
RGMII_TXD1: JP1.A8(LVDS2) U8.24(TXD1)
RGMII_TXD2: JP1.A9(LVDS3) U8.25(TXD2)
RGMII_TXD3: JP1.A10(LVDS4) U8.26(TXD3)
RGMII_TXEN: JP1.A12(LVDS6) U8.27(TXCTL)
NetB3_1: B3.1 C28.1 C29.1 C30.1 U8.44(VDDREG_2) U8.45(VDDREG_1)
NetB4_2: B4.2 C38.1 C39.1 C40.1 L3.1 U8.28(DVDD10_2) U8.36(DVDD10_1)
NetC44_1: C44.1 T1.1(TCT1) T1.4(TCT2) T1.7(TCT3) T1.10(TCT4)
NetC47_1: C47.1 R24.2 R25.2 R26.2 R32.2
NetC54_2: C54.2 R34.2 R35.2 U8.29(PHYRSTB)
NetJ2_21: R38.2 R40.2 ; port AY-
NetJ2_22: R36.2 R37.2 ; port AY+
NetJ2_25: R44.2 R45.2 ; port AG-
NetJ2_26: R41.2 R42.2 ; port AG+
NetJP1_A1: JP1.A1(IO1) R75.1(A)
NetJP1_A2: JP1.A2(IO2) R76.1(A)
NetJP1_B1: JP1.B1(+12V) JP1.B2(+12V) JP1.B3(+12V) JP1.B4(+12V) LED1.A(ANODE) U10.5(D) U10.6(D) U10.7(D) U10.8(D) U10.9(D)
NetJP1_C1: JP1.C1(IO6) R406.1 R411.1
NetJP1_C2: JP1.C2(IO7) R407.1 R410.1
NetJP1_C3: JP1.C3(IO8) R408.1 R409.1
NetL3_2: L3.2 U8.48(REGOUT)
NetLED1_K: LED1.K(CATHODE) R81.2
NetQ1_1: Q1.1(GATE) R58.2 R65.1
NetQ3_1: Q3.1(BASE) R73.1 R74.2
NetQ3_3: Q3.3(COLLECTOR) R65.2
NetQ5_1: Q5.1(BASE) R82.1 R83.2
NetQ5_3: Q5.3(COLLECTOR) R80.1
NetR24_1: R24.1 T1.15(MCT4)
NetR25_1: R25.1 T1.18(MCT3)
NetR26_1: R26.1 T1.21(MCT2)
NetR32_1: R32.1 T1.24(MCT1)
NetR39_2: R39.2 U8.42(CKXTAL1)
NetR43_2: R43.2 U8.39(ENREG/RSET)
NetR73_2: R73.2 R82.2 ; port G0_PWR_EN
NetR77_1: R77.1 R80.2 U10.4(G)
NetTP1_1: TP1.1(TP) U8.46(RSET/CLK125)

Not connected (* = marked no-connect by the designer): JP1 A14(LVDS8) A15(LVDS9) A16(LVDS10) B5(NC) B6(NC) C4(IO9) C5(IO10) C13(LVDSL7) C14(LVDSL8) C15(LVDSL9) C16(LVDSL10); U8 12(NC) 43(CKXTAL2)

### Notes on the sheet
- (Place
  these caps
  close to RJ45
  connector
  for EMI)
- MATCH ALL LENGTHS
  END TO END
  Z0 = 100 OHMS +/-10 OHMS
  NO STUBS
- MATCH ALL LENGTHS
  END TO END
  Z0 = 50 OHMS +/-10 OHMS
  NO STUBS
- GE0 Config
- 1 = Enable switching regulator
- 1=Wake On Lan Disable
- Pullup for Power Mgmt Enabled
  (active low signal)
- ADDR0
- ADDR1
- ADDR2
- SET PHY ADDR:001
- Pull up for 3.3V
- TXDLY
- RXDLY
- add 2ns delay to RXC/TXC for RXD/TXD latching or not
- SET:11
- AN0
- AN1
- Enable Auto Negotiation
- (in symbol CAP POL) +
- (in symbol GOSPELL) Title:; Rev:; Copyright:; Circuit:; Engineer:; Size:; Date:; Modify Date:; Sheet#:; out of:
- (in symbol RTL8211D_2) RTL8211E
- (in symbol SI7139) P

### Library data of the parts
B3-B5 L3 = CHOKE TORROID_0
C28-C60 = CAP NP_Dup1
C61 = CAP POL
C304 = CAP NP
LED1 = LED_1
Q1 = MOSFET P_0
Q3 Q5 = 2N3904
R24-R46 R48 R50-R56 R59-R64 R66-R68 R70-R72 R77 R80-R83 R406-R411 = R_Dup1
R47 R49 R58 R65 R73 R74 = R
R75 R76 = R_1: PARTS: 1; OriginalSymbolOrigin: (10,20); PINSWAP: (A,B); DEVICE: RK73H1JTTD7502F; PKG_TYPE: SR0603; LEVEL: STD; CODE: 7091238; %195%%232%%202%%246%: 片式厚膜电阻器-0.1W-75000OHM-+/-1%-0603; %182%%238%%182%%168%%185%%166%%194%%202%(W): 0.1; %215%%232%%214%%181%%212%%202%%208%%237%%198%%171%%178%%238%: +/-1%; COMPONENT_HIGH_MAX: 0.55MM; %208%%161%%192%%224%%195%%251%%179%%198%: 片式厚膜电阻器
R420 R421 R426 R427 = R_1: as R135 on sheet P07 PHY 2
T1 = PULSE H5007_0
U8 = RTL8211D_2
U9 = AS1117-X_3
*#6 = GOSPELL: Cage Code: 2017; Schematic Page Count: 9; Schematic Page Number: 6

## Sheet P05 CPLD.SchDoc
size 297 x 209 mm
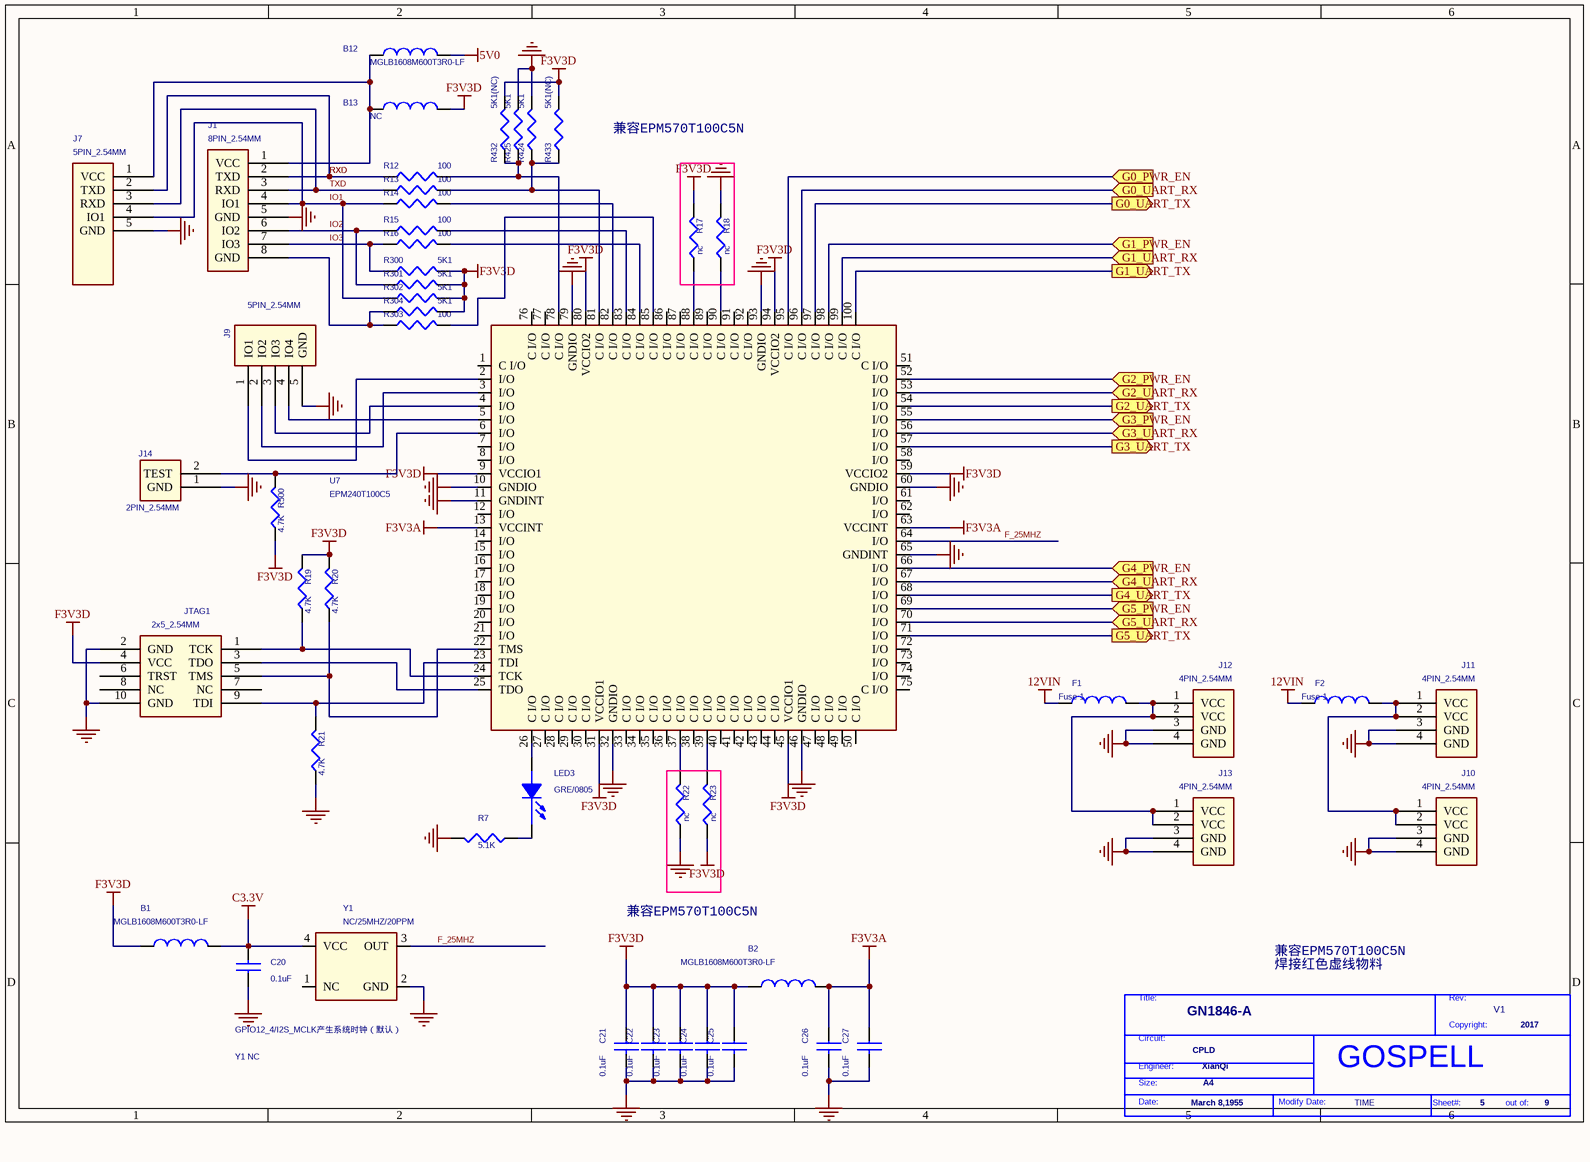
[diagram p6: P05 CPLD.SchDoc]

### Parts
(Parts that share a designator on the sheet are numbered #1, #2 ... from top to bottom, then left to right.)
*#7  Doc: CPLD  Page Count: 9  Page Number: 5  Page Create Date: March 8,1955  Page Size: A4  RevCode: V1  Title: GN1846-A  Copyright: 2017  Engineer: XianQi  Page Modify Date: TIME  (hidden comment: GOSPELL)  (graphical)
B1  MGLB1608M600T3R0-LF  [L0603]
B2  MGLB1608M600T3R0-LF  [L0603]
B12  MGLB1608M600T3R0-LF  [L0603]
B13  NC  [L0603]
C20  0.1uF  [0402C]
C21  0.1uF  [0402C]
C22  0.1uF  [0402C]
C23  0.1uF  [0402C]
C24  0.1uF  [0402C]
C25  0.1uF  [0402C]
C26  0.1uF  [0402C]
C27  0.1uF  [0402C]
F1  Fuse 1  [F15]
F2  Fuse 1  [F15]
J1  8PIN_2.54MM  [CON8_2D54MM_G]
J7  5PIN_2.54MM  [CON5_2D54MM_G]
J9  5PIN_2.54MM  [CON5_2D54MM_G]
J10  4PIN_2.54MM  [SIP4]
J11  4PIN_2.54MM  [SIP4]
J12  4PIN_2.54MM  [SIP4]
J13  4PIN_2.54MM  [SIP4]
J14  2PIN_2.54MM  [CN2]
JTAG1  2x5_2.54MM  [HERDER5X2]
LED3  GRE/0805  [LED0805]
R7  5.1K  [0402R]
R12  100  [0402R]
R13  100  [0402R]
R14  100  [0402R]
R15  100  [0402R]
R16  100  [0402R]
R17  nc  [0402R]
R18  nc  [0402R]
R19  4.7K  [0402R]
R20  4.7K  [0402R]
R21  4.7K  [0402R]
R22  nc  [0402R]
R23  nc  [0402R]
R300  5K1  [0402R]
R301  5K1  [0402R]
R302  5K1  [0402R]
R303  100  [0402R]
R304  5K1  [0402R]
R424  5K1  [0402R]
R425  5K1  [0402R]
R432  5K1(NC)  [0402R]
R433  5K1(NC)  [0402R]
R500  4.7K  [0402R]
U7  EPM240T100C5  [TQFP-100P]
Y1  NC/25MHZ/20PPM  [SCXO_7.0X5.0]

### Ports
G0_PWR_EN (in), G0_UART_RX (in), G0_UART_TX (out), G1_PWR_EN (in), G1_UART_RX (in), G1_UART_TX (out), G2_PWR_EN (in), G2_UART_RX (in), G2_UART_TX (out), G3_PWR_EN (in), G3_UART_RX (in), G3_UART_TX (out), G4_PWR_EN (in), G4_UART_RX (in), G4_UART_TX (out), G5_PWR_EN (in), G5_UART_RX (in), G5_UART_TX (out)

### Nets
5V0: B12.2
12VIN: F1.1 F2.1
C3.3V: B1.2 C20.2 Y1.4(VCC)
F3V3A: B2.2 C26.1 C27.1 U7.13(VCCINT) U7.63(VCCINT)
F3V3D: B1.1 B2.1 B13.2 C21.1 C22.1 C23.1 C24.1 C25.1 JTAG1.4(VCC) R17.1 R19.1 R20.1 R23.2 R300.1 R301.1 R302.1 R304.1 R432.1 R433.1 R500.2 U7.9(VCCIO1) U7.31(VCCIO1) U7.45(VCCIO1) U7.59(VCCIO2) U7.80(VCCIO2) U7.94(VCCIO2)
GND: C20.1 C21.2 C22.2 C23.2 C24.2 C25.2 C26.2 C27.2 J1.5(GND) J7.5(GND) J9.5(GND) J10.3(GND) J10.4(GND) J11.3(GND) J11.4(GND) J12.3(GND) J12.4(GND) J13.3(GND) J13.4(GND) J14.1(GND) JTAG1.2(GND) JTAG1.10(GND) R7.1 R18.1 R21.2 R22.2 R424.1 R425.1 U7.10(GNDIO) U7.11(GNDINT) U7.32(GNDIO) U7.46(GNDIO) U7.60(GNDIO) U7.65(GNDINT) U7.79(GNDIO) U7.93(GNDIO) Y1.2(GND)
F_25MHZ: U7.64(I/O) Y1.3(OUT)
G0_UART_RX: U7.96(C_I/O) ; port G0_UART_RX
G0_UART_TX: U7.97(C_I/O) ; port G0_UART_TX
G1_UART_RX: U7.99(C_I/O) ; port G1_UART_RX
G1_UART_TX: U7.100(C_I/O) ; port G1_UART_TX
G2_UART_RX: U7.53(I/O) ; port G2_UART_RX
G2_UART_TX: U7.54(I/O) ; port G2_UART_TX
IO1: J1.4(IO1) J7.4(IO1) R14.2 R302.2
IO2: J1.6(IO2) R15.2 R301.2
IO3: J1.7(IO3) R16.2 R300.2
RXD: J1.2(TXD) J7.2(TXD) R12.2
TXD: J1.3(RXD) J7.3(RXD) R13.2
NetB12_1: B12.1 B13.1 J1.1(VCC) J7.1(VCC)
NetF1_2: F1.2 J12.1(VCC) J12.2(VCC) J13.1(VCC) J13.2(VCC)
NetF2_2: F2.2 J10.1(VCC) J10.2(VCC) J11.1(VCC) J11.2(VCC)
NetJ1_8: J1.8(GND) R303.2 R304.2
NetJ6_18: U7.69(I/O) ; port G5_PWR_EN
NetJ6_19: U7.70(I/O) ; port G5_UART_RX
NetJ6_20: U7.71(I/O) ; port G5_UART_TX
NetJ6_21: U7.66(I/O) ; port G4_PWR_EN
NetJ6_22: U7.68(I/O) ; port G4_UART_TX
NetJ6_23: U7.67(I/O) ; port G4_UART_RX
NetJ6_24: U7.55(I/O) ; port G3_PWR_EN
NetJ6_25: U7.57(I/O) ; port G3_UART_TX
NetJ6_26: U7.56(I/O) ; port G3_UART_RX
NetJ9_1: J9.1(IO1) U7.2(I/O)
NetJ9_2: J9.2(IO2) U7.3(I/O)
NetJ9_3: J9.3(IO3) U7.4(I/O)
NetJ9_4: J9.4(IO4) U7.5(I/O)
NetJ14_2: J14.2(TEST) R500.1 U7.6(I/O)
NetJTAG1_1: JTAG1.1(TCK) R19.2 U7.24(TCK)
NetJTAG1_3: JTAG1.3(TDO) U7.25(TDO)
NetJTAG1_5: JTAG1.5(TMS) R20.2 U7.22(TMS)
NetJTAG1_9: JTAG1.9(TDI) R21.1 U7.23(TDI)
NetLED3_A: LED3.A(ANODE) U7.26(C_I/O)
NetLED3_K: LED3.K(CATHODE) R7.2
NetR12_1: R12.1 R425.2 R432.2 U7.78(C_I/O)
NetR13_1: R13.1 R424.2 R433.2 U7.81(C_I/O)
NetR14_1: R14.1 U7.82(C_I/O)
NetR15_1: R15.1 U7.83(C_I/O)
NetR16_1: R16.1 U7.84(C_I/O)
NetR17_2: R17.2 U7.88(C_I/O)
NetR18_2: R18.2 U7.90(C_I/O)
NetR22_1: R22.1 U7.37(C_I/O)
NetR23_1: R23.1 U7.39(C_I/O)
NetR73_2: U7.95(C_I/O) ; port G0_PWR_EN
NetR133_2: U7.98(C_I/O) ; port G1_PWR_EN
NetR193_2: U7.52(I/O) ; port G2_PWR_EN
NetR303_1: R303.1 U7.85(C_I/O)

Not connected (* = marked no-connect by the designer): JTAG1 6(TRST) 7(NC) 8(NC); U7 1(C_I/O) 7(I/O) 8(I/O) 12(I/O) 14(I/O) 15(I/O) 16(I/O) 17(I/O) 18(I/O) 19(I/O) 20(I/O) 21(I/O) 27(C_I/O) 28(C_I/O) 29(C_I/O) 30(C_I/O) 33(C_I/O) 34(C_I/O) 35(C_I/O) 36(C_I/O) 38(C_I/O) 40(C_I/O) 41(C_I/O) 42(C_I/O) 43(C_I/O) 44(C_I/O) 47(C_I/O) 48(C_I/O) 49(C_I/O) 50(C_I/O) 51(C_I/O) 58(I/O) 61(I/O) 62(I/O) 72(I/O) 73(I/O) 74(I/O) 75(C_I/O) 76(C_I/O) 77(C_I/O) 86(C_I/O) 87(C_I/O) 89(C_I/O) 91(C_I/O) 92(C_I/O); Y1 1(NC)

### Notes on the sheet
- 兼容EPM570T100C5N
- 焊接红色虚线物料
- GPIO12_4/I2S_MCLK产生系统时钟（默认）
- Y1 NC
- (in symbol GOSPELL) Title:; Rev:; Copyright:; Circuit:; Engineer:; Size:; Date:; Modify Date:; Sheet#:; out of:

### Library data of the parts
B1 B2 B12 B13 F1 F2 = CHOKE TORROID_0
C20 = CAP NP
C21-C27 = CAP NP_Dup1
J1 = CON8_0
J7 J9-J14 = CON8_1
JTAG1 = CON10A_0
LED3 = LED_0
R7 R12-R23 R300-R304 R424 R425 R432 R433 R500 = R_Dup1
Y1 = SCXO
*#7 = GOSPELL: Cage Code: 2017; Schematic Page Count: 9; Schematic Page Number: 5

## Sheet P02 Block.SchDoc
size 297 x 209 mm
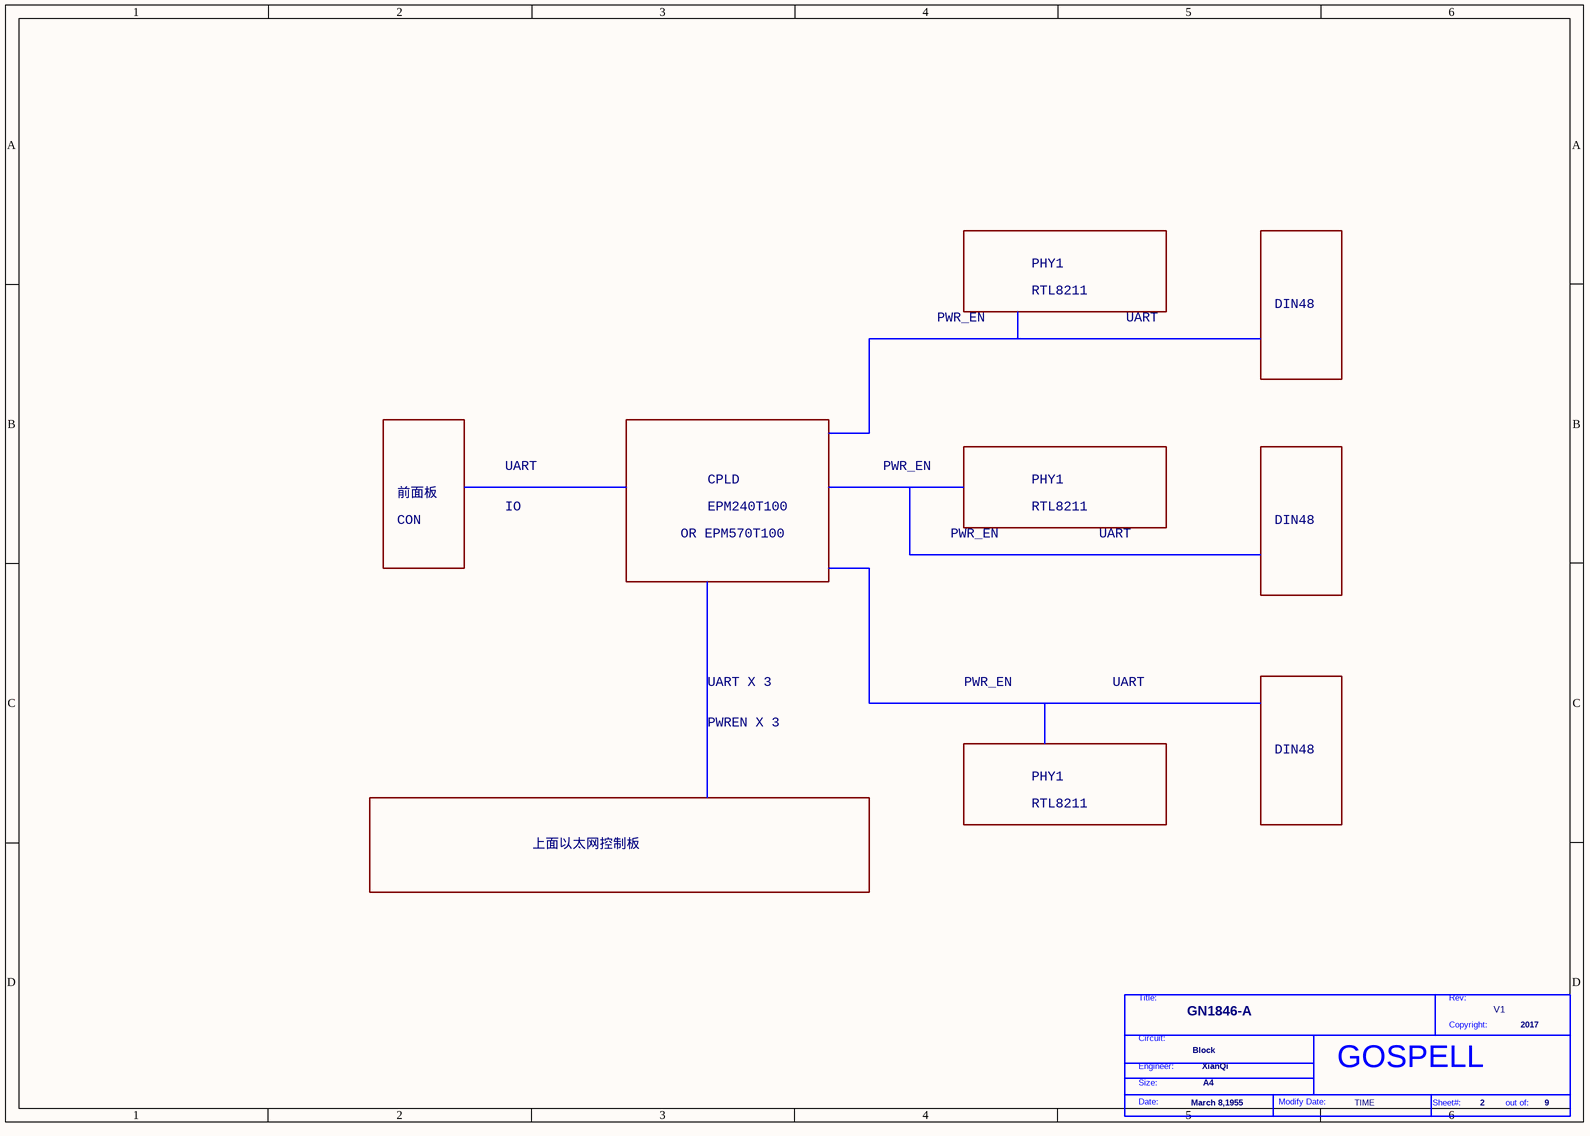
[diagram p7: P02 Block.SchDoc]

### Parts
(Parts that share a designator on the sheet are numbered #1, #2 ... from top to bottom, then left to right.)
*#8  Doc: Block  Page Count: 9  Page Number: 2  Page Create Date: March 8,1955  Page Size: A4  RevCode: V1  Title: GN1846-A  Copyright: 2017  Engineer: XianQi  Page Modify Date: TIME  (hidden comment: GOSPELL)  (graphical)

### Notes on the sheet
- PHY1
- PWR_EN
- RTL8211
- UART
- DIN48
- 前面板
- CON
- IO
- OR EPM570T100
- CPLD
- EPM240T100
- UART X 3
- PWREN X 3
- 上面以太网控制板
- (in symbol GOSPELL) Title:; Rev:; Copyright:; Circuit:; Engineer:; Size:; Date:; Modify Date:; Sheet#:; out of:

### Library data of the parts
*#8 = GOSPELL: Cage Code: 2017; Schematic Page Count: 9; Schematic Page Number: 2

## Sheet P01 Note & Title.SchDoc
size 297 x 209 mm
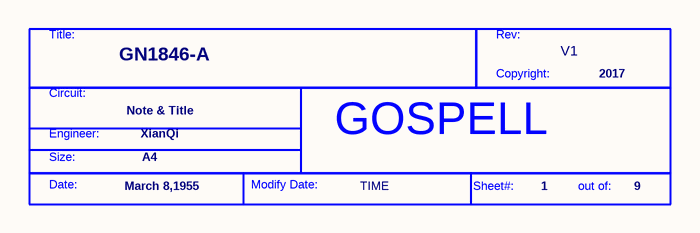
[diagram p8: P01 Note & Title.SchDoc]

### Parts
(Parts that share a designator on the sheet are numbered #1, #2 ... from top to bottom, then left to right.)
*#9  Doc: Note & Title  Page Count: 9  Page Number: 1  Page Create Date: March 8,1955  Page Size: A4  RevCode: V1  Title: GN1846-A  Copyright: 2017  Engineer: XianQi  Page Modify Date: TIME  (hidden comment: GOSPELL)  (graphical)

### Notes on the sheet
- (in symbol GOSPELL) Title:; Rev:; Copyright:; Circuit:; Engineer:; Size:; Date:; Modify Date:; Sheet#:; out of:

### Library data of the parts
*#9 = GOSPELL: Cage Code: 2017; Schematic Page Count: 9; Schematic Page Number: 1

## Nets that join several sheets
5V0: P04 Power (C12.1 C13.1 L2.2 U6.3), P07 PHY 2 (Q6.2 R109.2 R118.1), P09 CONNECT & LED (J8.9 J8.10 J8.11 J8.12), P08 PHY 3 (Q11.2 R169.2 R178.1), P06 PHY 1 (Q1.2 R49.2 R58.1), P05 CPLD (B12.2)
12VIN: P04 Power (21 pins), P07 PHY 2 (6 pins), P09 CONNECT & LED (8 pins), P08 PHY 3 (6 pins), P06 PHY 1 (6 pins), P05 CPLD (F1.1 F2.1)
F3V3D: P04 Power (C14.1 C15.1 U6.2 U6.4), P07 PHY 2 (R428.2 R429.2), P08 PHY 3 (R430.2 R431.2), P06 PHY 1 (R426.2 R427.2), P05 CPLD (26 pins)
GND: P04 Power (35 pins), P07 PHY 2 (71 pins), P09 CONNECT & LED (85 pins), P08 PHY 3 (71 pins), P06 PHY 1 (71 pins), P05 CPLD (37 pins)
A_MX1_N: P09 CONNECT & LED (J2.14), P06 PHY 1 (T1.22)
A_MX1_P: P09 CONNECT & LED (J2.13), P06 PHY 1 (T1.23)
A_MX2_N: P09 CONNECT & LED (J2.12), P06 PHY 1 (T1.19)
A_MX2_P: P09 CONNECT & LED (J2.11), P06 PHY 1 (T1.20)
A_MX3_N: P09 CONNECT & LED (J2.10), P06 PHY 1 (T1.16)
A_MX3_P: P09 CONNECT & LED (J2.9), P06 PHY 1 (T1.17)
A_MX4_N: P09 CONNECT & LED (J2.16), P06 PHY 1 (T1.13)
A_MX4_P: P09 CONNECT & LED (J2.15), P06 PHY 1 (T1.14)
B_MX1_N: P07 PHY 2 (T2.22), P09 CONNECT & LED (J2.8)
B_MX1_P: P07 PHY 2 (T2.23), P09 CONNECT & LED (J2.7)
B_MX2_N: P07 PHY 2 (T2.19), P09 CONNECT & LED (J2.6)
B_MX2_P: P07 PHY 2 (T2.20), P09 CONNECT & LED (J2.5)
B_MX3_N: P07 PHY 2 (T2.16), P09 CONNECT & LED (J2.2)
B_MX3_P: P07 PHY 2 (T2.17), P09 CONNECT & LED (J2.1)
B_MX4_N: P07 PHY 2 (T2.13), P09 CONNECT & LED (J2.4)
B_MX4_P: P07 PHY 2 (T2.14), P09 CONNECT & LED (J2.3)
C_MX1_N: P09 CONNECT & LED (J3.8), P08 PHY 3 (T3.22)
C_MX1_P: P09 CONNECT & LED (J3.7), P08 PHY 3 (T3.23)
C_MX2_N: P09 CONNECT & LED (J3.6), P08 PHY 3 (T3.19)
C_MX2_P: P09 CONNECT & LED (J3.5), P08 PHY 3 (T3.20)
C_MX3_N: P09 CONNECT & LED (J3.2), P08 PHY 3 (T3.16)
C_MX3_P: P09 CONNECT & LED (J3.1), P08 PHY 3 (T3.17)
C_MX4_N: P09 CONNECT & LED (J3.4), P08 PHY 3 (T3.13)
C_MX4_P: P09 CONNECT & LED (J3.3), P08 PHY 3 (T3.14)
G0_UART_RX: P06 PHY 1 (R75.2 R421.1 R426.1), P05 CPLD (U7.96)
G0_UART_TX: P06 PHY 1 (R76.2 R420.1 R427.1), P05 CPLD (U7.97)
G1_UART_RX: P07 PHY 2 (R135.2 R422.1 R428.1), P05 CPLD (U7.99)
G1_UART_TX: P07 PHY 2 (R137.2 R423.1 R429.1), P05 CPLD (U7.100)
G2_UART_RX: P08 PHY 3 (R195.2 R419.1 R430.1), P05 CPLD (U7.53)
G2_UART_TX: P08 PHY 3 (R196.2 R418.1 R431.1), P05 CPLD (U7.54)
NetJ2_19: P07 PHY 2 (R99.2 R101.2), P09 CONNECT & LED (J2.19)
NetJ2_20: P07 PHY 2 (R97.2 R98.2), P09 CONNECT & LED (J2.20)
NetJ2_21: P09 CONNECT & LED (J2.21), P06 PHY 1 (R38.2 R40.2)
NetJ2_22: P09 CONNECT & LED (J2.22), P06 PHY 1 (R36.2 R37.2)
NetJ2_23: P07 PHY 2 (R104.2 R105.2), P09 CONNECT & LED (J2.23)
NetJ2_24: P07 PHY 2 (R102.2 R103.2), P09 CONNECT & LED (J2.24)
NetJ2_25: P09 CONNECT & LED (J2.25), P06 PHY 1 (R44.2 R45.2)
NetJ2_26: P09 CONNECT & LED (J2.26), P06 PHY 1 (R41.2 R42.2)
NetJ3_19: P09 CONNECT & LED (J3.19), P08 PHY 3 (R159.2 R161.2)
NetJ3_20: P09 CONNECT & LED (J3.20), P08 PHY 3 (R157.2 R158.2)
NetJ3_23: P09 CONNECT & LED (J3.23), P08 PHY 3 (R164.2 R165.2)
NetJ3_24: P09 CONNECT & LED (J3.24), P08 PHY 3 (R162.2 R163.2)
NetJ6_18: P09 CONNECT & LED (J6.18), P05 CPLD (U7.69)
NetJ6_19: P09 CONNECT & LED (J6.19), P05 CPLD (U7.70)
NetJ6_20: P09 CONNECT & LED (J6.20), P05 CPLD (U7.71)
NetJ6_21: P09 CONNECT & LED (J6.21), P05 CPLD (U7.66)
NetJ6_22: P09 CONNECT & LED (J6.22), P05 CPLD (U7.68)
NetJ6_23: P09 CONNECT & LED (J6.23), P05 CPLD (U7.67)
NetJ6_24: P09 CONNECT & LED (J6.24), P05 CPLD (U7.55)
NetJ6_25: P09 CONNECT & LED (J6.25), P05 CPLD (U7.57)
NetJ6_26: P09 CONNECT & LED (J6.26), P05 CPLD (U7.56)
NetR73_2: P06 PHY 1 (R73.2 R82.2), P05 CPLD (U7.95)
NetR133_2: P07 PHY 2 (R133.2 R142.2), P05 CPLD (U7.98)
NetR193_2: P08 PHY 3 (R193.2 R202.2), P05 CPLD (U7.52)